# Altium project PC4-SODIMM_V200_RC_A1_20141015.PrjPcb (part 1 of 2)
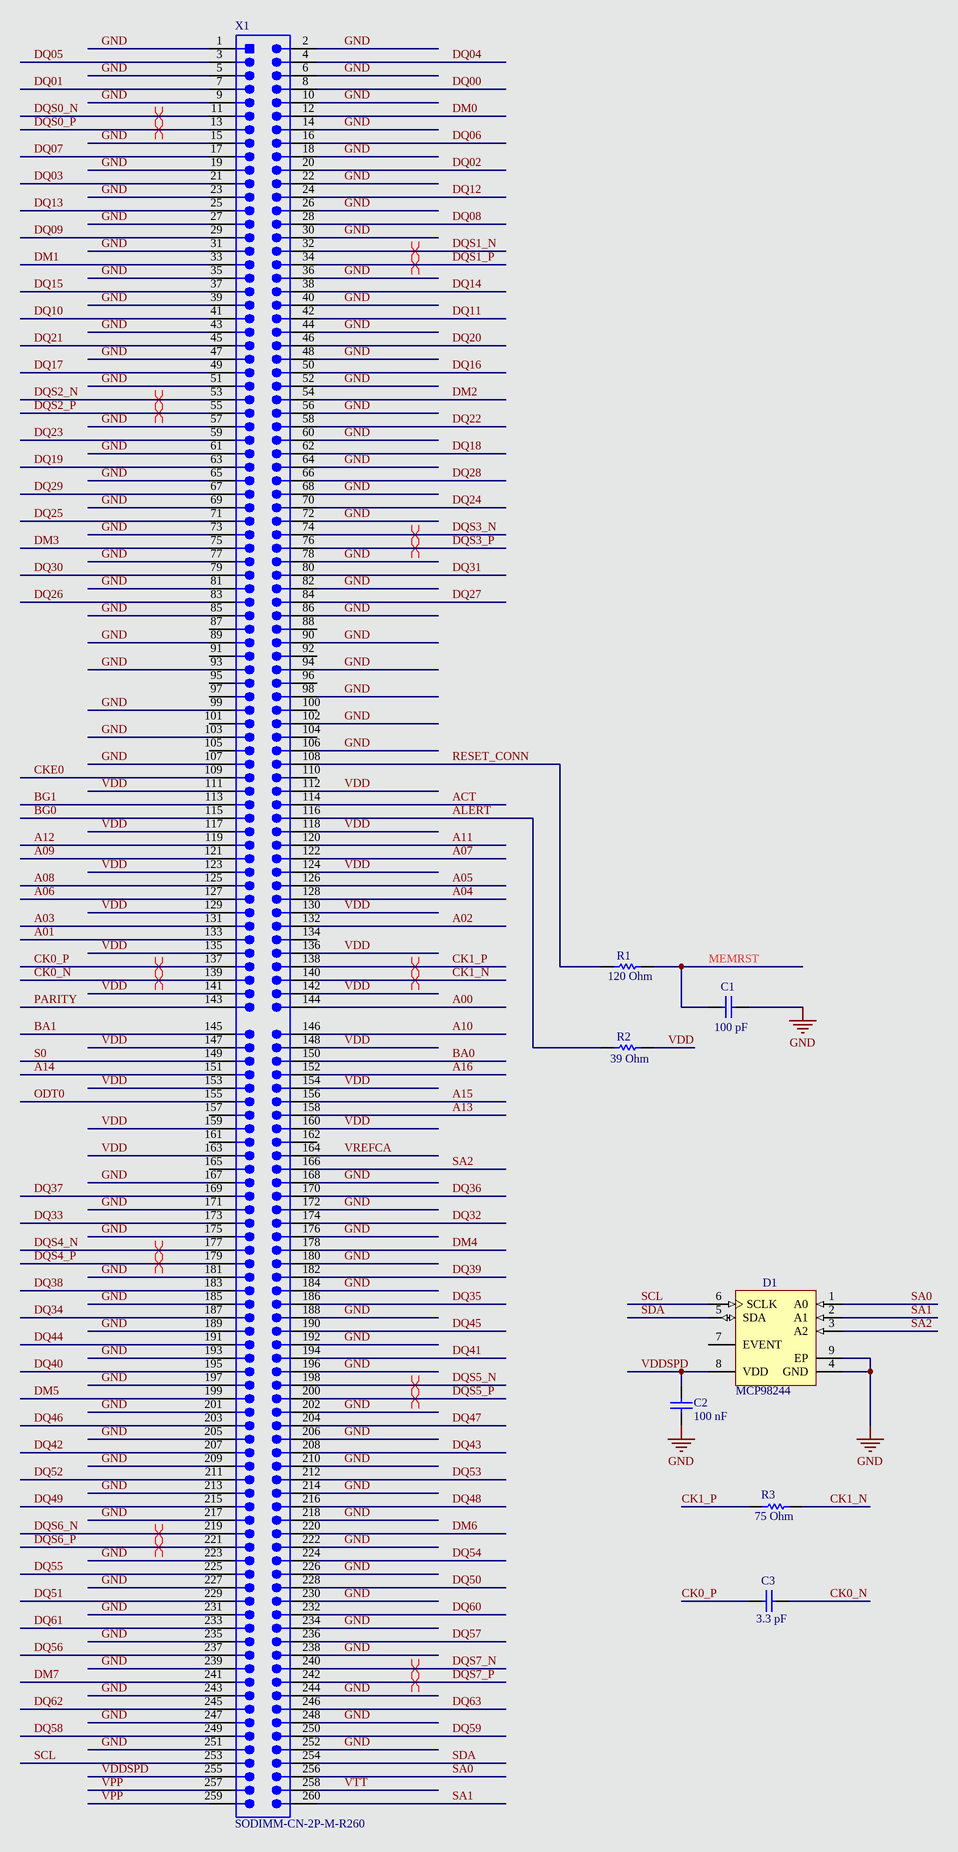
[diagram p0: Sheet1.SchDoc]
Project: Mini PC SODIMM; PrjCompanyName: Altium; PrjAddress4: 92037; PrjAddress3: La Jolla, CA, USA; PrjAddress2: Suite 700; PrjAddress1: 4225 Executive Sqr; CompanyWebsite: www.altium.com
5 sheets, 199 parts. Net scope: global (net labels, ports and power ports of the same name join across sheets).
Board file: PC4-SODIMM_V200_RC_A1_20141015.PcbDoc
Sheets:
  Sheet1.SchDoc
  Sheet2.SchDoc
  Sheet3.SchDoc
  Sheet4.SchDoc
  Sheet5.SchDoc

## Sheet Sheet1.SchDoc: Connector
size C; DocumentNumber: 1; SheetNumber: 1; SheetTotal: 5

### Parts
C1  Capacitance: 100 pF  [CAPC1005X55X10LL05]  (hidden comment: C1005C0G1H101K050BA)
C2  Capacitance: 100 nF  [CAPC1005X55X10LL05]  (hidden comment: C1005X7R1E104M)
C3  Capacitance: 3.3 pF  [CAPC1005X55X25NL5T10]  (hidden comment: GRM1555C1H3R3CA01D)
D1  MCP98244  [MCHP-TDFN-MNY8_V]
R1  Resistance: 120 Ohm  [RESC1005X40X25ML5T10]  (hidden comment: RC0402JR-07120RL)
R2  Resistance: 39 Ohm  [RESC1005X40X25NL5T10]  (hidden comment: RC0402JR-0739RL)
R3  Resistance: 75 Ohm  [RESC1005X40X25ML05T05]  (hidden comment: ERJ-2GEJ750X)
X1  SODIMM-CN-2P-M-R260  [SODIMM-GF-2D-500-1K-S260]  (no BOM)

### Nets
GND: C1.2 C2.1 D1.4(GND) D1.9(EP) X1.1 X1.2 X1.5 X1.6 X1.9 X1.10 X1.14 X1.15 X1.18 X1.19 X1.22 X1.23 X1.26 X1.27 X1.30 X1.31 X1.35 X1.36 X1.39 X1.40 X1.43 X1.44 X1.47 X1.48 X1.51 X1.52 X1.56 X1.57 X1.60 X1.61 X1.64 X1.65 X1.68 X1.69 X1.72 X1.73 X1.77 X1.78 X1.81 X1.82 X1.85 X1.86 X1.89 X1.90 X1.93 X1.94 X1.98 X1.99 X1.102 X1.103 X1.106 X1.107 X1.167 X1.168 X1.171 X1.172 X1.175 X1.176 X1.180 X1.181 X1.184 X1.185 X1.188 X1.189 X1.192 X1.193 X1.196 X1.197 X1.201 X1.202 X1.205 X1.206 X1.209 X1.210 X1.213 X1.214 X1.217 X1.218 X1.222 X1.223 X1.226 X1.227 X1.230 X1.231 X1.234 X1.235 X1.238 X1.239 X1.243 X1.244 X1.247 X1.248 X1.251 X1.252
A00: X1.144
A01: X1.133
A02: X1.132
A03: X1.131
A04: X1.128
A05: X1.126
A06: X1.127
A07: X1.122
A08: X1.125
A09: X1.121
A10: X1.146
A11: X1.120
A12: X1.119
A13: X1.158
A14: X1.151
A15: X1.156
A16: X1.152
ACT: X1.114
ALERT: R2.1 X1.116
BA0: X1.150
BA1: X1.145
BG0: X1.115
BG1: X1.113
CK0_N: C3.2 X1.139
CK0_P: C3.1 X1.137
CK1_N: R3.2 X1.140
CK1_P: R3.1 X1.138
CKE0: X1.109
DM0: X1.12
DM1: X1.33
DM2: X1.54
DM3: X1.75
DM4: X1.178
DM5: X1.199
DM6: X1.220
DM7: X1.241
DQ00: X1.8
DQ01: X1.7
DQ02: X1.20
DQ03: X1.21
DQ04: X1.4
DQ05: X1.3
DQ06: X1.16
DQ07: X1.17
DQ08: X1.28
DQ09: X1.29
DQ10: X1.41
DQ11: X1.42
DQ12: X1.24
DQ13: X1.25
DQ14: X1.38
DQ15: X1.37
DQ16: X1.50
DQ17: X1.49
DQ18: X1.62
DQ19: X1.63
DQ20: X1.46
DQ21: X1.45
DQ22: X1.58
DQ23: X1.59
DQ24: X1.70
DQ25: X1.71
DQ26: X1.83
DQ27: X1.84
DQ28: X1.66
DQ29: X1.67
DQ30: X1.79
DQ31: X1.80
DQ32: X1.174
DQ33: X1.173
DQ34: X1.187
DQ35: X1.186
DQ36: X1.170
DQ37: X1.169
DQ38: X1.183
DQ39: X1.182
DQ40: X1.195
DQ41: X1.194
DQ42: X1.207
DQ43: X1.208
DQ44: X1.191
DQ45: X1.190
DQ46: X1.203
DQ47: X1.204
DQ48: X1.216
DQ49: X1.215
DQ50: X1.228
DQ51: X1.229
DQ52: X1.211
DQ53: X1.212
DQ54: X1.224
DQ55: X1.225
DQ56: X1.237
DQ57: X1.236
DQ58: X1.249
DQ59: X1.250
DQ60: X1.232
DQ61: X1.233
DQ62: X1.245
DQ63: X1.246
DQS0_N: X1.11
DQS0_P: X1.13
DQS1_N: X1.32
DQS1_P: X1.34
DQS2_N: X1.53
DQS2_P: X1.55
DQS3_N: X1.74
DQS3_P: X1.76
DQS4_N: X1.177
DQS4_P: X1.179
DQS5_N: X1.198
DQS5_P: X1.200
DQS6_N: X1.219
DQS6_P: X1.221
DQS7_N: X1.240
DQS7_P: X1.242
MEMRST: C1.1 R1.2
ODT0: X1.155
PARITY: X1.143
RESET_CONN: R1.1 X1.108
S0: X1.149
SA0: D1.1(A0) X1.256
SA1: D1.2(A1) X1.260
SA2: D1.3(A2) X1.166
SCL: D1.6(SCLK) X1.253
SDA: D1.5(SDA) X1.254
VDD: R2.2 X1.111 X1.112 X1.117 X1.118 X1.123 X1.124 X1.129 X1.130 X1.135 X1.136 X1.141 X1.142 X1.147 X1.148 X1.153 X1.154 X1.159 X1.160 X1.163
VDDSPD: C2.2 D1.8(VDD) X1.255
VPP: X1.257 X1.259
VREFCA: X1.164
VTT: X1.258

Not connected (* = marked no-connect by the designer): D1 7(EVENT); X1 87 88 91 92 95 96 97 100 101 104 105 110 134 157 161 162 165

### Layout directives
differential pair: CK0_N, CK0_P, CK1_N, CK1_P, DQS0_N, DQS0_P, DQS1_N, DQS1_P, DQS2_N, DQS2_P, DQS3_N, DQS3_P, DQS4_N, DQS4_P, DQS5_N, DQS5_P, DQS6_N, DQS6_P, DQS7_N, DQS7_P

### Notes on the sheet
- Title
- Size:
- Date:
- File:
- C
- Number:
- Time:
- Revision:
- Sheet
- of

### Library data of the parts
C1 = CMP-1663-00011-2: Chip Capacitor, 100 pF, +/- 10%, 50 V, -55 to 125 degC, 0402 (1005 Metric), RoHS, Tape and Reel; Voltage Rating: 50 V; ComponentLink2URL: http://datasheet.octopart.com/C-Series-Ceramic-Chip-Capacitors-TDK-datasheet-family-84.pdf; Package Quantity: 10000; DatasheetVersion: 04/2012; Mounting Technology: Surface Mount; ComponentLink1Description: Manufacturer URL; Packaging: Tape and Reel; Tolerance: 10%; Max Operating Temperature: 125 degC; RoHSCompliant: true; ComponentLink1URL: http://www.tdk.com/; Min Operating Temperature: -55 degC; PackageDescription: 2-Pin Surface Mount Device, Body 1 x 0.5 mm; Case/Package: 0402; Mount: Surface Mount; PartNumber: C1005C0G1H101K050BA; ComponentLink2Description: Datasheet
C2 = CMP-1663-00009-2: Chip Capacitor, 0.1 uF, +/- 20%, 25 V, -55 to 125 degC, 0402 (1005 Metric), RoHS, Tape and Reel; Voltage Rating: 25 V; Type (Capacitors): X7R; Case\/Package: 0402; PackageReference: 0402; Tolerance: 20%; Height: 0.5 mm; Package Quantity: 10000; Mounting Technology: Surface Mount; Width: 0.5 mm; Packaging: Tape and Reel; Case Code (Metric): 1005; Pins: 2; Voltage Rating (DC): 25 V; ComponentLink2URL: http://www.farnell.com/datasheets/1571323.pdf; ComponentLink1URL: http://www.tdk.com/; PackageDescription: 2-Pin Surface Mount Device, Body 1 x 0.5 mm; Max Operating Temperature: 125 degC; ComponentLink2Description: Datasheet; PartNumber: C1005X7R1E104M; Mount: Surface Mount; RoHSCompliant: true; ComponentLink1Description: Manufacturer URL; Min Operating Temperature: -55 degC; Length: 1 mm; Case Code (Imperial): 0402; DatasheetVersion: 09/2011
C3 = CMP-2008-04352-2: Chip Capacitor, 3.3 pF, +/- 0.25 pF, 50 V, -55 to 125 degC, 0402 (1005 Metric), RoHS, Tape and Reel; Type (Capacitors): C0G; Voltage Rating: 50 V; PartNumber: GRM1555C1H3R3CA01D; Package Quantity: 10000; Mounting Technology: Surface Mount; Case Code (Metric): 1005; ComponentLink1Description: Manufacturer URL; PackageDescription: 2-Pin Surface Mount Device, Body 1 x 0.5 mm; Length: 0.039 inch; RoHSCompliant: true; ComponentLink1URL: http://www.murata.com/; Height: 0.5 mm; Max Operating Temperature: 125 degC; REACH SVHC: No SVHC; ComponentLink2URL: http://search.murata.co.jp/Ceramy/image/img/A01X/G101/ENG/GRM1555C1H3R3CA01-01.pdf; Width: 0.02 inch; Mount: Surface Mount; Min Operating Temperature: -55 degC; Case Code (Imperial): 0402; Case/Package: 0402; Radiation Hardening: No; Voltage Rating (DC): 50 V; ComponentLink2Description: Datasheet; Packaging: Tape and Reel; DatasheetVersion: 03/2016
D1 = CMP-1721-00006-1: DDR4 DIMM Temperature Sensor with EEPROM for SPD, 1.7 to 3.6 V, -65 to 150 degC, 8-PinTDFN, Pb-free, Tape and Reel; PackageDescription: 8-Pin Thin Dual Flat No-lead Package, Body 2 x 3 mm, Pitch 0.5 mm; Mounting Technology: Surface Mount; ComponentLink1Description: Manufacturer URL; ComponentLink2Description: Datasheet; ComponentLink2URL: http://ww1.microchip.com/downloads/en/DeviceDoc/22327C.pdf; PartNumber: MCP98244; DatasheetVersion: Rev. C, 05/2013; ComponentLink1URL: http://www.microchip.com/
R1 = CMP-2002-07920-2: Chip Resistor, 120 Ohm, +/- 5%, 0.063 W, -55 to 155 degC, 0402 (1005 Metric), RoHS, Tape and Reel; Voltage Rating: 50 V; Type (Resistor): Thick Film; Power Rating: 63 mW; Packaging: Tape and Reel; Tolerance: 5%; Case/Package: 0402; Min Operating Temperature: -55 degC; DatasheetVersion: Rev. 4, 02/2016; Pins: 2; Width: 0.5 mm; Mount: Surface Mount; ComponentLink1Description: Manufacturer URL; Package Quantity: 10000; Max Operating Temperature: 155 degC; Case Code (Metric): 1005; PackageDescription: 2-Pin Surface Mount Device, Body 1 x 0.5 mm; Height: 0.35 mm; Mounting Technology: Surface Mount; ComponentLink1URL: http://www.yageo.com/; ComponentLink2URL: http://www.yageo.com/documents/recent/PYu-RC_Group_51_RoHS_L_04.pdf; RoHSCompliant: true; Case Code (Imperial): 0402; Voltage Rating (DC): 50 V; REACH SVHC: No SVHC; ComponentLink2Description: Datasheet; Length: 1 mm; PartNumber: RC0402JR-07120RL
R2 = CMP-2002-07994-2: Chip Resistor, 39 Ohm, +/- 5%, 0.063 W, -55 to 155 degC, 0402 (1005 Metric), RoHS, Tape and Reel; Power Rating: 63 mW; Voltage Rating (DC): 50 V; Case Code (Imperial): 0402; Mount: Surface Mount; Max Operating Temperature: 155 degC; Case Code (Metric): 1005; ComponentLink1Description: Manufacturer URL; PackageDescription: 2-Pin Surface Mount Device, Body 1 x 0.5 mm; PartNumber: RC0402JR-0739RL; ComponentLink2Description: Datasheet; Tolerance: 5%; Height: 0.35 mm; Pins: 2; Min Operating Temperature: -55 degC; Length: 1 mm; DatasheetVersion: Rev. 4, 02/2016; ComponentLink2URL: http://www.yageo.com/documents/recent/PYu-RC_Group_51_RoHS_L_04.pdf; Mounting Technology: Surface Mount; Packaging: Cut Tape; Case/Package: 0402; Package Quantity: 1; RoHSCompliant: true; REACH SVHC: No SVHC; Width: 0.5 mm; Voltage Rating: 50 V; ComponentLink1URL: http://www.yageo.com/
R3 = CMP-2002-00578-3: Chip Resistor, 75 Ohm, +/- 5%, 100 mW, -55 to 155 degC, 0402 (1005 Metric), RoHS, Tape and Reel; Manufacturer: Basic Passives; Power Rating: 100 mW; Voltage Rating: 50 V; Case\/Package: 0402; Height: 0.35 mm; PackageReference: 0402; Package Quantity: 10000; Mounting Technology: Surface Mount; Tolerance: 5%; Length: 1 mm; ComponentLink2URL: http://industrial.panasonic.com/cdbs/www-data/pdf/RDA0000/AOA0000C84.pdf; Mount: Surface Mount; DatasheetVersion: 03/2015; RoHSCompliant: true; PartNumber: ERJ-2GEJ750X; Max Operating Temperature: 155 degC; REACH SVHC: Unknown; ComponentLink2Description: Datasheet; Case Code (Imperial): 0402; ComponentLink1URL: http://www.panasonic.com/; PackageDescription: 2-Pin Surface Mount Device, Body 1 x 0.5 mm; Radiation Hardening: No; Width: 0.5 mm; Pins: 2; ComponentLink1Description: Manufacturer URL; Packaging: Tape and Reel; Min Operating Temperature: -55 degC; Case Code (Metric): 1005
X1 = CMP-0001-00005-1: Golden finger, SODIMM, Dual, Staggered, Pitch 0.5mm, 260-Position; Class Name: Edge Connector; Mating Connector: AS0A823-H4SB-7H; System: Connector; Package Reference: SODIMM-GF-2D-500-1K-S260; Publisher: Altium

## Sheet Sheet2.SchDoc: TERMINATION RESISTORS
size B; DocumentNumber: 2; SheetNumber: 2; SheetTotal: 5
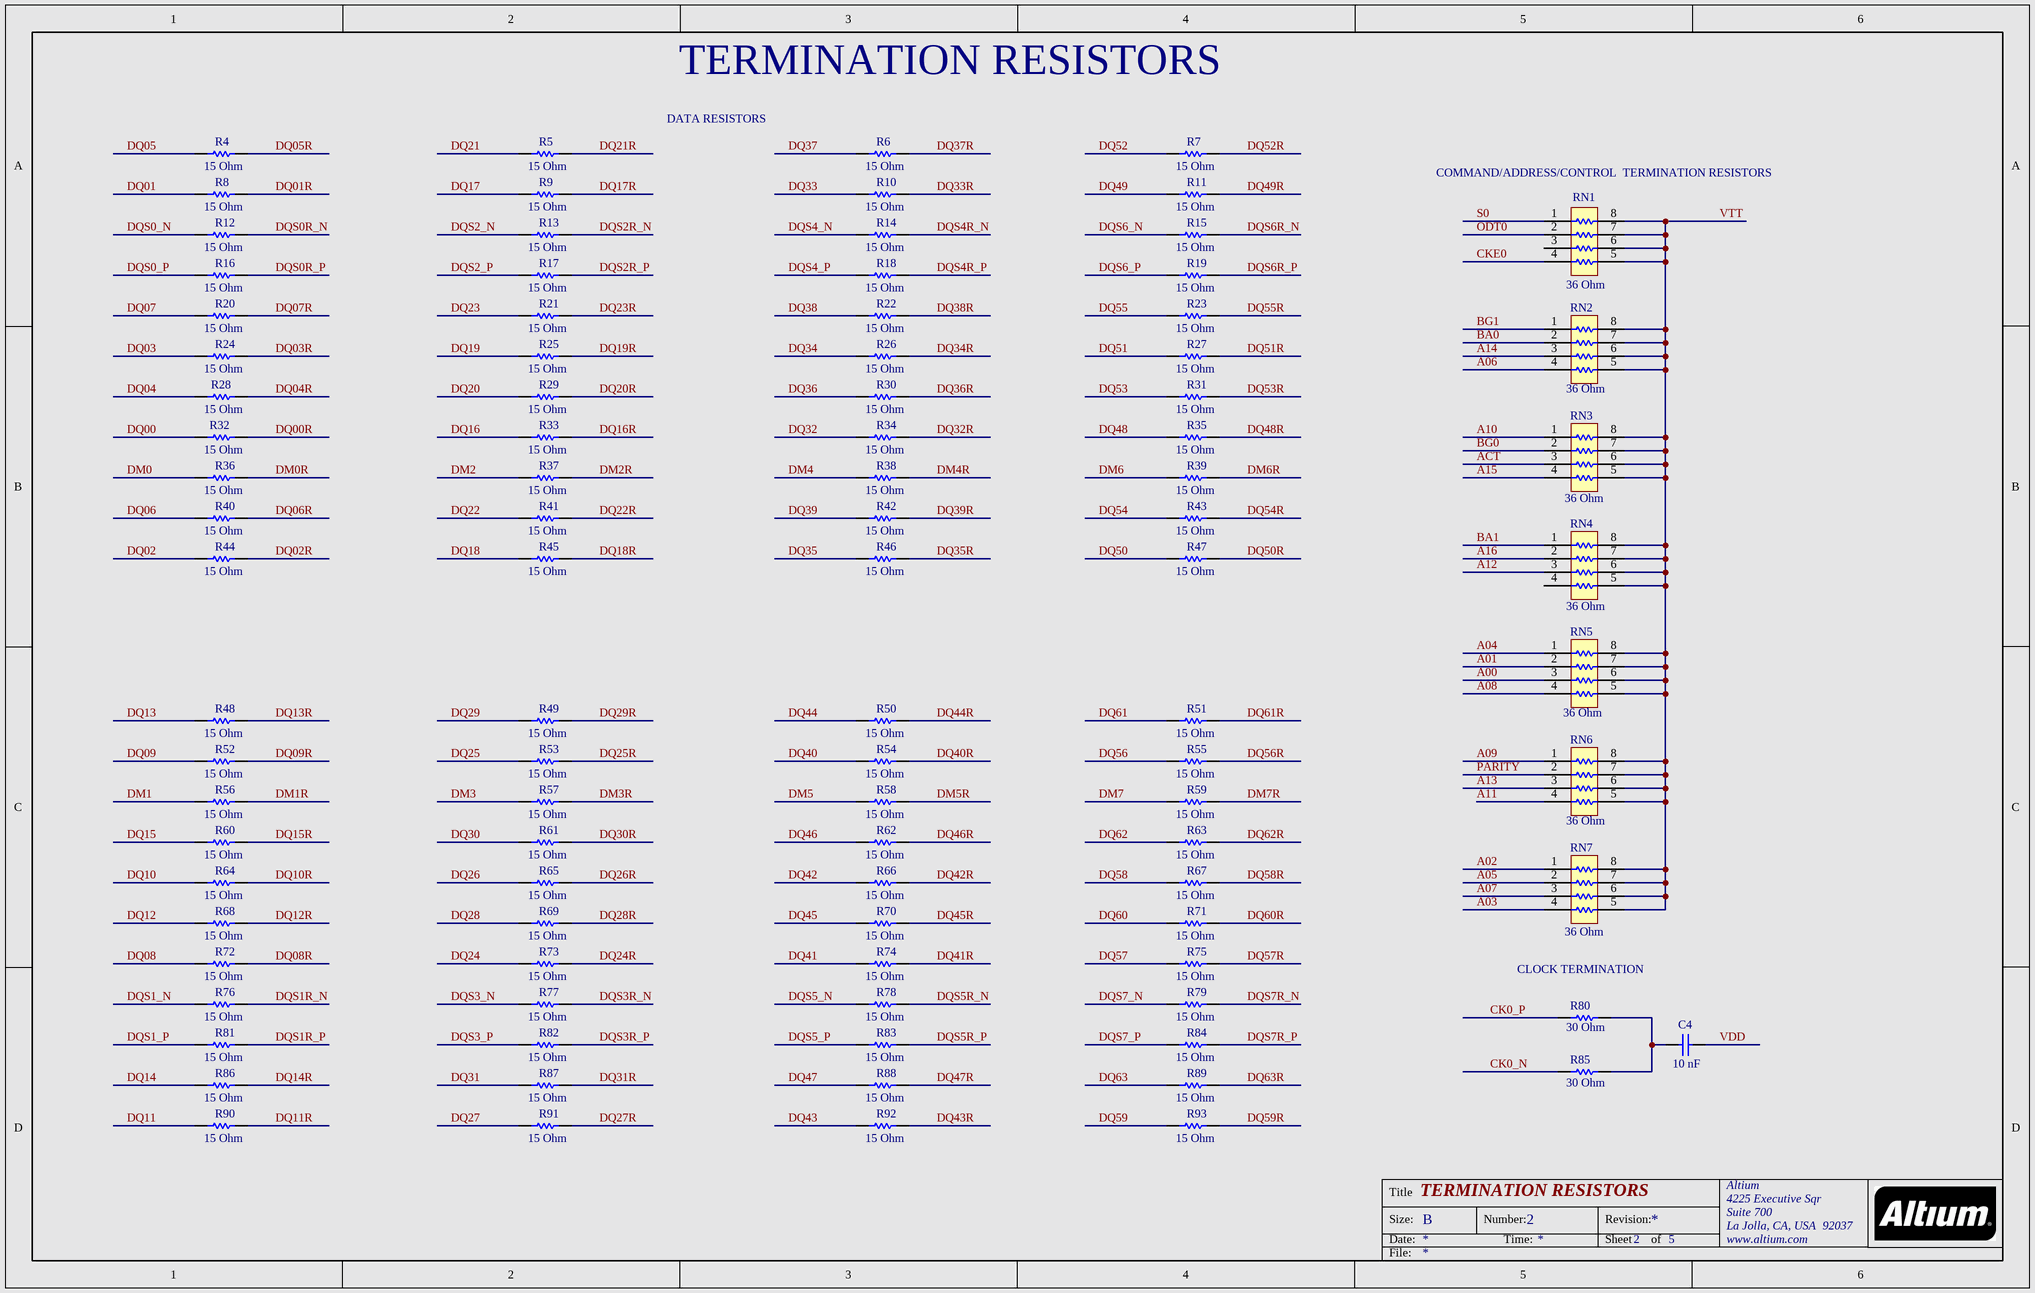
[diagram p1: Sheet2.SchDoc]

### Parts
C4  Capacitance: 10 nF  [CAPC1005X55X10NL05]  (hidden comment: C1005X7R1E103M050BB)
R4  Resistance: 15 Ohm  [RESC0603X26X15ML03T05]  (hidden comment: ERJ-1GEJ150C)
R5  Resistance: 15 Ohm  [RESC0603X26X15ML03T05]  (hidden comment: ERJ-1GEJ150C)
R6  Resistance: 15 Ohm  [RESC0603X26X15ML03T05]  (hidden comment: ERJ-1GEJ150C)
R7  Resistance: 15 Ohm  [RESC0603X26X15ML03T05]  (hidden comment: ERJ-1GEJ150C)
R8  Resistance: 15 Ohm  [RESC0603X26X15ML03T05]  (hidden comment: ERJ-1GEJ150C)
R9  Resistance: 15 Ohm  [RESC0603X26X15ML03T05]  (hidden comment: ERJ-1GEJ150C)
R10  Resistance: 15 Ohm  [RESC0603X26X15ML03T05]  (hidden comment: ERJ-1GEJ150C)
R11  Resistance: 15 Ohm  [RESC0603X26X15ML03T05]  (hidden comment: ERJ-1GEJ150C)
R12  Resistance: 15 Ohm  [RESC0603X26X15ML03T05]  (hidden comment: ERJ-1GEJ150C)
R13  Resistance: 15 Ohm  [RESC0603X26X15ML03T05]  (hidden comment: ERJ-1GEJ150C)
R14  Resistance: 15 Ohm  [RESC0603X26X15ML03T05]  (hidden comment: ERJ-1GEJ150C)
R15  Resistance: 15 Ohm  [RESC0603X26X15ML03T05]  (hidden comment: ERJ-1GEJ150C)
R16  Resistance: 15 Ohm  [RESC0603X26X15ML03T05]  (hidden comment: ERJ-1GEJ150C)
R17  Resistance: 15 Ohm  [RESC0603X26X15ML03T05]  (hidden comment: ERJ-1GEJ150C)
R18  Resistance: 15 Ohm  [RESC0603X26X15ML03T05]  (hidden comment: ERJ-1GEJ150C)
R19  Resistance: 15 Ohm  [RESC0603X26X15ML03T05]  (hidden comment: ERJ-1GEJ150C)
R20  Resistance: 15 Ohm  [RESC0603X26X15ML03T05]  (hidden comment: ERJ-1GEJ150C)
R21  Resistance: 15 Ohm  [RESC0603X26X15ML03T05]  (hidden comment: ERJ-1GEJ150C)
R22  Resistance: 15 Ohm  [RESC0603X26X15ML03T05]  (hidden comment: ERJ-1GEJ150C)
R23  Resistance: 15 Ohm  [RESC0603X26X15ML03T05]  (hidden comment: ERJ-1GEJ150C)
R24  Resistance: 15 Ohm  [RESC0603X26X15ML03T05]  (hidden comment: ERJ-1GEJ150C)
R25  Resistance: 15 Ohm  [RESC0603X26X15ML03T05]  (hidden comment: ERJ-1GEJ150C)
R26  Resistance: 15 Ohm  [RESC0603X26X15ML03T05]  (hidden comment: ERJ-1GEJ150C)
R27  Resistance: 15 Ohm  [RESC0603X26X15ML03T05]  (hidden comment: ERJ-1GEJ150C)
R28  Resistance: 15 Ohm  [RESC0603X26X15ML03T05]  (hidden comment: ERJ-1GEJ150C)
R29  Resistance: 15 Ohm  [RESC0603X26X15ML03T05]  (hidden comment: ERJ-1GEJ150C)
R30  Resistance: 15 Ohm  [RESC0603X26X15ML03T05]  (hidden comment: ERJ-1GEJ150C)
R31  Resistance: 15 Ohm  [RESC0603X26X15ML03T05]  (hidden comment: ERJ-1GEJ150C)
R32  Resistance: 15 Ohm  [RESC0603X26X15ML03T05]  (hidden comment: ERJ-1GEJ150C)
R33  Resistance: 15 Ohm  [RESC0603X26X15ML03T05]  (hidden comment: ERJ-1GEJ150C)
R34  Resistance: 15 Ohm  [RESC0603X26X15ML03T05]  (hidden comment: ERJ-1GEJ150C)
R35  Resistance: 15 Ohm  [RESC0603X26X15ML03T05]  (hidden comment: ERJ-1GEJ150C)
R36  Resistance: 15 Ohm  [RESC0603X26X15ML03T05]  (hidden comment: ERJ-1GEJ150C)
R37  Resistance: 15 Ohm  [RESC0603X26X15ML03T05]  (hidden comment: ERJ-1GEJ150C)
R38  Resistance: 15 Ohm  [RESC0603X26X15ML03T05]  (hidden comment: ERJ-1GEJ150C)
R39  Resistance: 15 Ohm  [RESC0603X26X15ML03T05]  (hidden comment: ERJ-1GEJ150C)
R40  Resistance: 15 Ohm  [RESC0603X26X15ML03T05]  (hidden comment: ERJ-1GEJ150C)
R41  Resistance: 15 Ohm  [RESC0603X26X15ML03T05]  (hidden comment: ERJ-1GEJ150C)
R42  Resistance: 15 Ohm  [RESC0603X26X15ML03T05]  (hidden comment: ERJ-1GEJ150C)
R43  Resistance: 15 Ohm  [RESC0603X26X15ML03T05]  (hidden comment: ERJ-1GEJ150C)
R44  Resistance: 15 Ohm  [RESC0603X26X15ML03T05]  (hidden comment: ERJ-1GEJ150C)
R45  Resistance: 15 Ohm  [RESC0603X26X15ML03T05]  (hidden comment: ERJ-1GEJ150C)
R46  Resistance: 15 Ohm  [RESC0603X26X15ML03T05]  (hidden comment: ERJ-1GEJ150C)
R47  Resistance: 15 Ohm  [RESC0603X26X15ML03T05]  (hidden comment: ERJ-1GEJ150C)
R48  Resistance: 15 Ohm  [RESC0603X26X15ML03T05]  (hidden comment: ERJ-1GEJ150C)
R49  Resistance: 15 Ohm  [RESC0603X26X15ML03T05]  (hidden comment: ERJ-1GEJ150C)
R50  Resistance: 15 Ohm  [RESC0603X26X15ML03T05]  (hidden comment: ERJ-1GEJ150C)
R51  Resistance: 15 Ohm  [RESC0603X26X15ML03T05]  (hidden comment: ERJ-1GEJ150C)
R52  Resistance: 15 Ohm  [RESC0603X26X15ML03T05]  (hidden comment: ERJ-1GEJ150C)
R53  Resistance: 15 Ohm  [RESC0603X26X15ML03T05]  (hidden comment: ERJ-1GEJ150C)
R54  Resistance: 15 Ohm  [RESC0603X26X15ML03T05]  (hidden comment: ERJ-1GEJ150C)
R55  Resistance: 15 Ohm  [RESC0603X26X15ML03T05]  (hidden comment: ERJ-1GEJ150C)
R56  Resistance: 15 Ohm  [RESC0603X26X15ML03T05]  (hidden comment: ERJ-1GEJ150C)
R57  Resistance: 15 Ohm  [RESC0603X26X15ML03T05]  (hidden comment: ERJ-1GEJ150C)
R58  Resistance: 15 Ohm  [RESC0603X26X15ML03T05]  (hidden comment: ERJ-1GEJ150C)
R59  Resistance: 15 Ohm  [RESC0603X26X15ML03T05]  (hidden comment: ERJ-1GEJ150C)
R60  Resistance: 15 Ohm  [RESC0603X26X15ML03T05]  (hidden comment: ERJ-1GEJ150C)
R61  Resistance: 15 Ohm  [RESC0603X26X15ML03T05]  (hidden comment: ERJ-1GEJ150C)
R62  Resistance: 15 Ohm  [RESC0603X26X15ML03T05]  (hidden comment: ERJ-1GEJ150C)
R63  Resistance: 15 Ohm  [RESC0603X26X15ML03T05]  (hidden comment: ERJ-1GEJ150C)
R64  Resistance: 15 Ohm  [RESC0603X26X15ML03T05]  (hidden comment: ERJ-1GEJ150C)
R65  Resistance: 15 Ohm  [RESC0603X26X15ML03T05]  (hidden comment: ERJ-1GEJ150C)
R66  Resistance: 15 Ohm  [RESC0603X26X15ML03T05]  (hidden comment: ERJ-1GEJ150C)
R67  Resistance: 15 Ohm  [RESC0603X26X15ML03T05]  (hidden comment: ERJ-1GEJ150C)
R68  Resistance: 15 Ohm  [RESC0603X26X15ML03T05]  (hidden comment: ERJ-1GEJ150C)
R69  Resistance: 15 Ohm  [RESC0603X26X15ML03T05]  (hidden comment: ERJ-1GEJ150C)
R70  Resistance: 15 Ohm  [RESC0603X26X15ML03T05]  (hidden comment: ERJ-1GEJ150C)
R71  Resistance: 15 Ohm  [RESC0603X26X15ML03T05]  (hidden comment: ERJ-1GEJ150C)
R72  Resistance: 15 Ohm  [RESC0603X26X15ML03T05]  (hidden comment: ERJ-1GEJ150C)
R73  Resistance: 15 Ohm  [RESC0603X26X15ML03T05]  (hidden comment: ERJ-1GEJ150C)
R74  Resistance: 15 Ohm  [RESC0603X26X15ML03T05]  (hidden comment: ERJ-1GEJ150C)
R75  Resistance: 15 Ohm  [RESC0603X26X15ML03T05]  (hidden comment: ERJ-1GEJ150C)
R76  Resistance: 15 Ohm  [RESC0603X26X15ML03T05]  (hidden comment: ERJ-1GEJ150C)
R77  Resistance: 15 Ohm  [RESC0603X26X15ML03T05]  (hidden comment: ERJ-1GEJ150C)
R78  Resistance: 15 Ohm  [RESC0603X26X15ML03T05]  (hidden comment: ERJ-1GEJ150C)
R79  Resistance: 15 Ohm  [RESC0603X26X15ML03T05]  (hidden comment: ERJ-1GEJ150C)
R80  Resistance: 30 Ohm  [RESC1005X40X25NL5T10]  (hidden comment: RC0402JR-0730RL)
R81  Resistance: 15 Ohm  [RESC0603X26X15ML03T05]  (hidden comment: ERJ-1GEJ150C)
R82  Resistance: 15 Ohm  [RESC0603X26X15ML03T05]  (hidden comment: ERJ-1GEJ150C)
R83  Resistance: 15 Ohm  [RESC0603X26X15ML03T05]  (hidden comment: ERJ-1GEJ150C)
R84  Resistance: 15 Ohm  [RESC0603X26X15ML03T05]  (hidden comment: ERJ-1GEJ150C)
R85  Resistance: 30 Ohm  [RESC1005X40X25NL5T10]  (hidden comment: RC0402JR-0730RL)
R86  Resistance: 15 Ohm  [RESC0603X26X15ML03T05]  (hidden comment: ERJ-1GEJ150C)
R87  Resistance: 15 Ohm  [RESC0603X26X15ML03T05]  (hidden comment: ERJ-1GEJ150C)
R88  Resistance: 15 Ohm  [RESC0603X26X15ML03T05]  (hidden comment: ERJ-1GEJ150C)
R89  Resistance: 15 Ohm  [RESC0603X26X15ML03T05]  (hidden comment: ERJ-1GEJ150C)
R90  Resistance: 15 Ohm  [RESC0603X26X15ML03T05]  (hidden comment: ERJ-1GEJ150C)
R91  Resistance: 15 Ohm  [RESC0603X26X15ML03T05]  (hidden comment: ERJ-1GEJ150C)
R92  Resistance: 15 Ohm  [RESC0603X26X15ML03T05]  (hidden comment: ERJ-1GEJ150C)
R93  Resistance: 15 Ohm  [RESC0603X26X15ML03T05]  (hidden comment: ERJ-1GEJ150C)
RN1  Resistance: 36 Ohm  [BOUR-CAY10-J4_V]  (hidden comment: CAY10-360J4LF)
RN2  Resistance: 36 Ohm  [BOUR-CAY10-J4_V]  (hidden comment: CAY10-360J4LF)
RN3  Resistance: 36 Ohm  [BOUR-CAY10-J4_V]  (hidden comment: CAY10-360J4LF)
RN4  Resistance: 36 Ohm  [BOUR-CAY10-J4_V]  (hidden comment: CAY10-360J4LF)
RN5  Resistance: 36 Ohm  [BOUR-CAY10-J4_V]  (hidden comment: CAY10-360J4LF)
RN6  Resistance: 36 Ohm  [BOUR-CAY10-J4_V]  (hidden comment: CAY10-360J4LF)
RN7  Resistance: 36 Ohm  [BOUR-CAY10-J4_V]  (hidden comment: CAY10-360J4LF)

### Nets
A00: RN5.3
A01: RN5.2
A02: RN7.1
A03: RN7.4
A04: RN5.1
A05: RN7.2
A06: RN2.4
A07: RN7.3
A08: RN5.4
A09: RN6.1
A10: RN3.1
A11: RN6.4
A12: RN4.3
A13: RN6.3
A14: RN2.3
A15: RN3.4
A16: RN4.2
ACT: RN3.3
BA0: RN2.2
BA1: RN4.1
BG0: RN3.2
BG1: RN2.1
CK0_N: R85.1
CK0_P: R80.1
CKE0: RN1.4
DM0: R36.1
DM0R: R36.2
DM1: R56.1
DM1R: R56.2
DM2: R37.1
DM2R: R37.2
DM3: R57.1
DM3R: R57.2
DM4: R38.1
DM4R: R38.2
DM5: R58.1
DM5R: R58.2
DM6: R39.1
DM6R: R39.2
DM7: R59.1
DM7R: R59.2
DQ00: R32.1
DQ00R: R32.2
DQ01: R8.1
DQ01R: R8.2
DQ02: R44.1
DQ02R: R44.2
DQ03: R24.1
DQ03R: R24.2
DQ04: R28.1
DQ04R: R28.2
DQ05: R4.1
DQ05R: R4.2
DQ06: R40.1
DQ06R: R40.2
DQ07: R20.1
DQ07R: R20.2
DQ08: R72.1
DQ08R: R72.2
DQ09: R52.1
DQ09R: R52.2
DQ10: R64.1
DQ10R: R64.2
DQ11: R90.1
DQ11R: R90.2
DQ12: R68.1
DQ12R: R68.2
DQ13: R48.1
DQ13R: R48.2
DQ14: R86.1
DQ14R: R86.2
DQ15: R60.1
DQ15R: R60.2
DQ16: R33.1
DQ16R: R33.2
DQ17: R9.1
DQ17R: R9.2
DQ18: R45.1
DQ18R: R45.2
DQ19: R25.1
DQ19R: R25.2
DQ20: R29.1
DQ20R: R29.2
DQ21: R5.1
DQ21R: R5.2
DQ22: R41.1
DQ22R: R41.2
DQ23: R21.1
DQ23R: R21.2
DQ24: R73.1
DQ24R: R73.2
DQ25: R53.1
DQ25R: R53.2
DQ26: R65.1
DQ26R: R65.2
DQ27: R91.1
DQ27R: R91.2
DQ28: R69.1
DQ28R: R69.2
DQ29: R49.1
DQ29R: R49.2
DQ30: R61.1
DQ30R: R61.2
DQ31: R87.1
DQ31R: R87.2
DQ32: R34.1
DQ32R: R34.2
DQ33: R10.1
DQ33R: R10.2
DQ34: R26.1
DQ34R: R26.2
DQ35: R46.1
DQ35R: R46.2
DQ36: R30.1
DQ36R: R30.2
DQ37: R6.1
DQ37R: R6.2
DQ38: R22.1
DQ38R: R22.2
DQ39: R42.1
DQ39R: R42.2
DQ40: R54.1
DQ40R: R54.2
DQ41: R74.1
DQ41R: R74.2
DQ42: R66.1
DQ42R: R66.2
DQ43: R92.1
DQ43R: R92.2
DQ44: R50.1
DQ44R: R50.2
DQ45: R70.1
DQ45R: R70.2
DQ46: R62.1
DQ46R: R62.2
DQ47: R88.1
DQ47R: R88.2
DQ48: R35.1
DQ48R: R35.2
DQ49: R11.1
DQ49R: R11.2
DQ50: R47.1
DQ50R: R47.2
DQ51: R27.1
DQ51R: R27.2
DQ52: R7.1
DQ52R: R7.2
DQ53: R31.1
DQ53R: R31.2
DQ54: R43.1
DQ54R: R43.2
DQ55: R23.1
DQ55R: R23.2
DQ56: R55.1
DQ56R: R55.2
DQ57: R75.1
DQ57R: R75.2
DQ58: R67.1
DQ58R: R67.2
DQ59: R93.1
DQ59R: R93.2
DQ60: R71.1
DQ60R: R71.2
DQ61: R51.1
DQ61R: R51.2
DQ62: R63.1
DQ62R: R63.2
DQ63: R89.1
DQ63R: R89.2
DQS0_N: R12.1
DQS0_P: R16.1
DQS0R_N: R12.2
DQS0R_P: R16.2
DQS1_N: R76.1
DQS1_P: R81.1
DQS1R_N: R76.2
DQS1R_P: R81.2
DQS2_N: R13.1
DQS2_P: R17.1
DQS2R_N: R13.2
DQS2R_P: R17.2
DQS3_N: R77.1
DQS3_P: R82.1
DQS3R_N: R77.2
DQS3R_P: R82.2
DQS4_N: R14.1
DQS4_P: R18.1
DQS4R_N: R14.2
DQS4R_P: R18.2
DQS5_N: R78.1
DQS5_P: R83.1
DQS5R_N: R78.2
DQS5R_P: R83.2
DQS6_N: R15.1
DQS6_P: R19.1
DQS6R_N: R15.2
DQS6R_P: R19.2
DQS7_N: R79.1
DQS7_P: R84.1
DQS7R_N: R79.2
DQS7R_P: R84.2
ODT0: RN1.2
PARITY: RN6.2
S0: RN1.1
VDD: C4.2
VTT: RN1.5 RN1.6 RN1.7 RN1.8 RN2.5 RN2.6 RN2.7 RN2.8 RN3.5 RN3.6 RN3.7 RN3.8 RN4.5 RN4.6 RN4.7 RN4.8 RN5.5 RN5.6 RN5.7 RN5.8 RN6.5 RN6.6 RN6.7 RN6.8 RN7.5 RN7.6 RN7.7 RN7.8
NetC4_1: C4.1 R80.2 R85.2

Not connected (* = marked no-connect by the designer): RN1 3; RN4 4

### Notes on the sheet
- DATA RESISTORS
- (near RN1) COMMAND/ADDRESS/CONTROL  TERMINATION RESISTORS
- CLOCK TERMINATION
- Title
- Size:
- Date:
- B
- Number:
- Time:
- Revision:
- Sheet
- of
- File:

### Library data of the parts
C4 = CMP-1663-00012-1: Chip Capacitor, 10 nF, +/- 15%, 25 V, -55 to 125 degC, 0402 (1005 Metric), RoHS, Tape and Reel; Voltage Rating: 25 V; Type (Capacitors): X7R; Tolerance: 20%; Width: 0.5 mm; ComponentLink2Description: Datasheet; Max Operating Temperature: 125 degC; PartNumber: C1005X7R1E103M050BB; Mounting Technology: Surface Mount; Case Code (Metric): 1005; ComponentLink1Description: Manufacturer URL; Case Code (Imperial): 0402; PackageDescription: 2-Pin Surface Mount Device, Body 1 x 0.5 mm; ComponentLink1URL: http://www.tdk.com/; Mount: Surface Mount; Package Quantity: 10000; ComponentLink2URL: https://ciiva.com/datasheet-click-20389836?src=ciiva&sig=78734acc; Voltage Rating (DC): 25 V; Length: 1 mm; DatasheetVersion: 03/2015; Height: 0.5 mm; RoHSCompliant: true; Case/Package: 0402; Packaging: Tape and Reel; Min Operating Temperature: -55 degC
R4-R79 R81-R84 R86-R93 = CMP-2004-03155-3: Chip Resistor, 15 Ohm, +/- 5%, 0.05 W, -55 to 125 degC, 0201 (0603 Metric), RoHS, Tape and Reel; Voltage Rating: 25 V; Power Rating: 50 mW; PackageDescription: 2-Pin Surface Mount Device, Body 0.6 x 0.3 mm; Width: 0.3 mm; Length: 0.6 mm; Height: 0.23 mm; Packaging: Tape and Reel; Case Code (Metric): 0603; RoHSCompliant: true; Case/Package: 0201; ComponentLink2Description: Datasheet; Package Quantity: 15000; Max Operating Temperature: 125 degC; Tolerance: 5%; ComponentLink1URL: http://www.panasonic.com/; Min Operating Temperature: -55 degC; PartNumber: ERJ-1GEJ150C; ComponentLink1Description: Manufacturer URL; ComponentLink2URL: http://media.digikey.com/pdf/Data%20Sheets/Panasonic%20Resistors%20Thermistors%20PDFs/ERJ%205%25.pdf; DatasheetVersion: 03/2005; Case Code (Imperial): 0201; Mounting Technology: Surface Mount
R80 R85 = CMP-2002-07983-2: Chip Resistor, 30 Ohm, +/- 5%, 0.063 W, -55 to 155 degC, 0402 (1005 Metric), RoHS, Tape and Reel; Voltage Rating: 50 V; Power Rating: 63 mW; Case/Package: 0402; ComponentLink2URL: http://www.yageo.com/documents/recent/PYu-RC_Group_51_RoHS_L_04.pdf; Height: 0.35 mm; RoHSCompliant: true; Case Code (Imperial): 0402; ComponentLink1URL: http://www.yageo.com/; Width: 0.5 mm; Tolerance: 5%; Max Operating Temperature: 155 degC; PackageDescription: 2-Pin Surface Mount Device, Body 1 x 0.5 mm; Radiation Hardening: No; Min Operating Temperature: -55 degC; PartNumber: RC0402JR-0730RL; Packaging: Tape and Reel; ComponentLink2Description: Datasheet; Length: 1 mm; Package Quantity: 10000; Case Code (Metric): 1005; ComponentLink1Description: Manufacturer URL; DatasheetVersion: Rev. 4, 02/2016; Mounting Technology: Surface Mount; Mount: Surface Mount
RN1-RN7 = CMP-1734-00001-1: Chip Resistor Array, 36 Ohm, +/- 5%, 62.5 mW, -55 to 125 degC, 8-Pin SMD, RoHS, Tape and Reel; Power Rating: 120 mW; Type (Resistor): Thick Film; ComponentLink1URL: http://www.bourns.com/; ComponentLink2Description: Datasheet; Height: 0.018 inch; Mounting Technology: Surface Mount; ComponentLink2URL: http://www.bourns.com/docs/Product-Datasheets/CAY10.pdf; PartNumber: CAY10-360J4LF; Case Code (Metric): 2010; ComponentLink1Description: Manufacturer URL; DatasheetVersion: 01/2015; Width: 0.039 inch; Packaging: Tape and Reel; Pins: 8; RoHSCompliant: true; Mount: Surface Mount; Package Quantity: 10000; Length: 0.079 inch; PackageDescription: 8-Pin Surface Mount Device, Body 2 x 1 mm, Pitch 0.5 mm; Max Operating Temperature: 125 degC; Min Operating Temperature: -55 degC; Case/Package: 0804; Tolerance: 5%

## Sheet Sheet3.SchDoc: Memory ICs
size B; DocumentNumber: 3; SheetNumber: 3; SheetTotal: 5
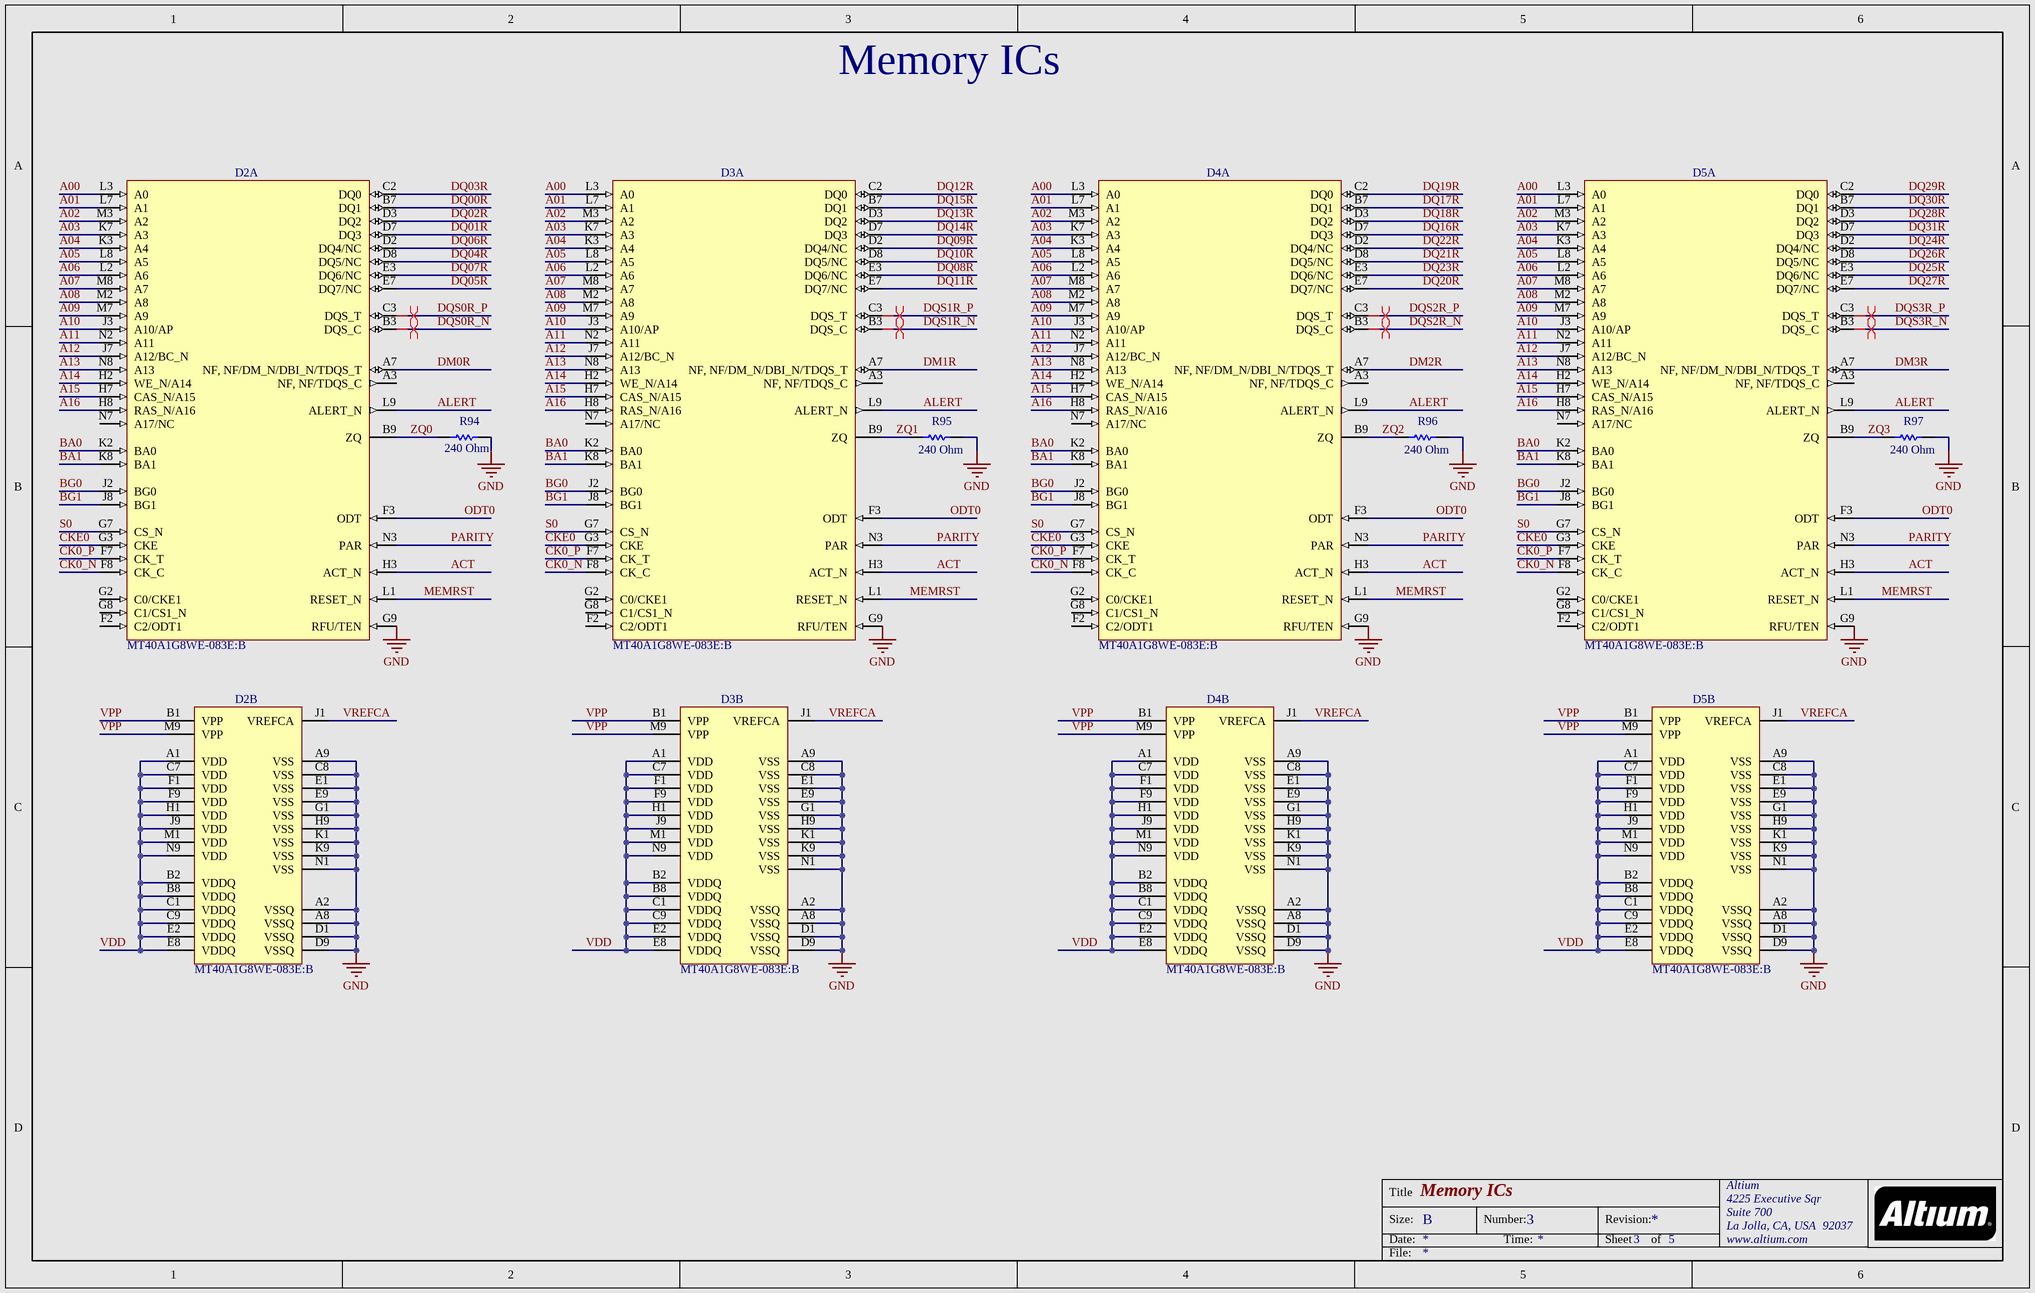
[diagram p2: Sheet3.SchDoc]

### Parts
D2  MT40A1G8WE-083E:B  [MICT-WE-78]  (parts A,B of 2)
D3  MT40A1G8WE-083E:B  [MICT-WE-78]  (parts A,B of 2)
D4  MT40A1G8WE-083E:B  [MICT-WE-78]  (parts A,B of 2)
D5  MT40A1G8WE-083E:B  [MICT-WE-78]  (parts A,B of 2)
R94  Resistance: 240 Ohm  [RESC1005X40X25ML05T05]  (hidden comment: ERJ-2GEJ241x)
R95  Resistance: 240 Ohm  [RESC1005X40X25ML05T05]  (hidden comment: ERJ-2GEJ241x)
R96  Resistance: 240 Ohm  [RESC1005X40X25ML05T05]  (hidden comment: ERJ-2GEJ241x)
R97  Resistance: 240 Ohm  [RESC1005X40X25ML05T05]  (hidden comment: ERJ-2GEJ241x)

### Nets
GND: D2.A2(VSSQ) D2.A8(VSSQ) D2.A9(VSS) D2.C8(VSS) D2.D1(VSSQ) D2.D9(VSSQ) D2.E1(VSS) D2.E9(VSS) D2.G1(VSS) D2.G9(RFU/TEN) D2.H9(VSS) D2.K1(VSS) D2.K9(VSS) D2.N1(VSS) D3.A2(VSSQ) D3.A8(VSSQ) D3.A9(VSS) D3.C8(VSS) D3.D1(VSSQ) D3.D9(VSSQ) D3.E1(VSS) D3.E9(VSS) D3.G1(VSS) D3.G9(RFU/TEN) D3.H9(VSS) D3.K1(VSS) D3.K9(VSS) D3.N1(VSS) D4.A2(VSSQ) D4.A8(VSSQ) D4.A9(VSS) D4.C8(VSS) D4.D1(VSSQ) D4.D9(VSSQ) D4.E1(VSS) D4.E9(VSS) D4.G1(VSS) D4.G9(RFU/TEN) D4.H9(VSS) D4.K1(VSS) D4.K9(VSS) D4.N1(VSS) D5.A2(VSSQ) D5.A8(VSSQ) D5.A9(VSS) D5.C8(VSS) D5.D1(VSSQ) D5.D9(VSSQ) D5.E1(VSS) D5.E9(VSS) D5.G1(VSS) D5.G9(RFU/TEN) D5.H9(VSS) D5.K1(VSS) D5.K9(VSS) D5.N1(VSS) R94.1 R95.1 R96.1 R97.1
A00: D2.L3(A0) D3.L3(A0) D4.L3(A0) D5.L3(A0)
A01: D2.L7(A1) D3.L7(A1) D4.L7(A1) D5.L7(A1)
A02: D2.M3(A2) D3.M3(A2) D4.M3(A2) D5.M3(A2)
A03: D2.K7(A3) D3.K7(A3) D4.K7(A3) D5.K7(A3)
A04: D2.K3(A4) D3.K3(A4) D4.K3(A4) D5.K3(A4)
A05: D2.L8(A5) D3.L8(A5) D4.L8(A5) D5.L8(A5)
A06: D2.L2(A6) D3.L2(A6) D4.L2(A6) D5.L2(A6)
A07: D2.M8(A7) D3.M8(A7) D4.M8(A7) D5.M8(A7)
A08: D2.M2(A8) D3.M2(A8) D4.M2(A8) D5.M2(A8)
A09: D2.M7(A9) D3.M7(A9) D4.M7(A9) D5.M7(A9)
A10: D2.J3(A10/AP) D3.J3(A10/AP) D4.J3(A10/AP) D5.J3(A10/AP)
A11: D2.N2(A11) D3.N2(A11) D4.N2(A11) D5.N2(A11)
A12: D2.J7(A12/BC_N) D3.J7(A12/BC_N) D4.J7(A12/BC_N) D5.J7(A12/BC_N)
A13: D2.N8(A13) D3.N8(A13) D4.N8(A13) D5.N8(A13)
A14: D2.H2(WE_N/A14) D3.H2(WE_N/A14) D4.H2(WE_N/A14) D5.H2(WE_N/A14)
A15: D2.H7(CAS_N/A15) D3.H7(CAS_N/A15) D4.H7(CAS_N/A15) D5.H7(CAS_N/A15)
A16: D2.H8(RAS_N/A16) D3.H8(RAS_N/A16) D4.H8(RAS_N/A16) D5.H8(RAS_N/A16)
ACT: D2.H3(ACT_N) D3.H3(ACT_N) D4.H3(ACT_N) D5.H3(ACT_N)
ALERT: D2.L9(ALERT_N) D3.L9(ALERT_N) D4.L9(ALERT_N) D5.L9(ALERT_N)
BA0: D2.K2(BA0) D3.K2(BA0) D4.K2(BA0) D5.K2(BA0)
BA1: D2.K8(BA1) D3.K8(BA1) D4.K8(BA1) D5.K8(BA1)
BG0: D2.J2(BG0) D3.J2(BG0) D4.J2(BG0) D5.J2(BG0)
BG1: D2.J8(BG1) D3.J8(BG1) D4.J8(BG1) D5.J8(BG1)
CK0_N: D2.F8(CK_C) D3.F8(CK_C) D4.F8(CK_C) D5.F8(CK_C)
CK0_P: D2.F7(CK_T) D3.F7(CK_T) D4.F7(CK_T) D5.F7(CK_T)
CKE0: D2.G3(CKE) D3.G3(CKE) D4.G3(CKE) D5.G3(CKE)
DM0R: D2.A7(NF,_NF/DM_N/DBI_N/TDQS_T)
DM1R: D3.A7(NF,_NF/DM_N/DBI_N/TDQS_T)
DM2R: D4.A7(NF,_NF/DM_N/DBI_N/TDQS_T)
DM3R: D5.A7(NF,_NF/DM_N/DBI_N/TDQS_T)
DQ00R: D2.B7(DQ1)
DQ01R: D2.D7(DQ3)
DQ02R: D2.D3(DQ2)
DQ03R: D2.C2(DQ0)
DQ04R: D2.D8(DQ5/NC)
DQ05R: D2.E7(DQ7/NC)
DQ06R: D2.D2(DQ4/NC)
DQ07R: D2.E3(DQ6/NC)
DQ08R: D3.E3(DQ6/NC)
DQ09R: D3.D2(DQ4/NC)
DQ10R: D3.D8(DQ5/NC)
DQ11R: D3.E7(DQ7/NC)
DQ12R: D3.C2(DQ0)
DQ13R: D3.D3(DQ2)
DQ14R: D3.D7(DQ3)
DQ15R: D3.B7(DQ1)
DQ16R: D4.D7(DQ3)
DQ17R: D4.B7(DQ1)
DQ18R: D4.D3(DQ2)
DQ19R: D4.C2(DQ0)
DQ20R: D4.E7(DQ7/NC)
DQ21R: D4.D8(DQ5/NC)
DQ22R: D4.D2(DQ4/NC)
DQ23R: D4.E3(DQ6/NC)
DQ24R: D5.D2(DQ4/NC)
DQ25R: D5.E3(DQ6/NC)
DQ26R: D5.D8(DQ5/NC)
DQ27R: D5.E7(DQ7/NC)
DQ28R: D5.D3(DQ2)
DQ29R: D5.C2(DQ0)
DQ30R: D5.B7(DQ1)
DQ31R: D5.D7(DQ3)
DQS0R_N: D2.B3(DQS_C)
DQS0R_P: D2.C3(DQS_T)
DQS1R_N: D3.B3(DQS_C)
DQS1R_P: D3.C3(DQS_T)
DQS2R_N: D4.B3(DQS_C)
DQS2R_P: D4.C3(DQS_T)
DQS3R_N: D5.B3(DQS_C)
DQS3R_P: D5.C3(DQS_T)
MEMRST: D2.L1(RESET_N) D3.L1(RESET_N) D4.L1(RESET_N) D5.L1(RESET_N)
ODT0: D2.F3(ODT) D3.F3(ODT) D4.F3(ODT) D5.F3(ODT)
PARITY: D2.N3(PAR) D3.N3(PAR) D4.N3(PAR) D5.N3(PAR)
S0: D2.G7(CS_N) D3.G7(CS_N) D4.G7(CS_N) D5.G7(CS_N)
VDD: D2.A1(VDD) D2.B2(VDDQ) D2.B8(VDDQ) D2.C1(VDDQ) D2.C7(VDD) D2.C9(VDDQ) D2.E2(VDDQ) D2.E8(VDDQ) D2.F1(VDD) D2.F9(VDD) D2.H1(VDD) D2.J9(VDD) D2.M1(VDD) D2.N9(VDD) D3.A1(VDD) D3.B2(VDDQ) D3.B8(VDDQ) D3.C1(VDDQ) D3.C7(VDD) D3.C9(VDDQ) D3.E2(VDDQ) D3.E8(VDDQ) D3.F1(VDD) D3.F9(VDD) D3.H1(VDD) D3.J9(VDD) D3.M1(VDD) D3.N9(VDD) D4.A1(VDD) D4.B2(VDDQ) D4.B8(VDDQ) D4.C1(VDDQ) D4.C7(VDD) D4.C9(VDDQ) D4.E2(VDDQ) D4.E8(VDDQ) D4.F1(VDD) D4.F9(VDD) D4.H1(VDD) D4.J9(VDD) D4.M1(VDD) D4.N9(VDD) D5.A1(VDD) D5.B2(VDDQ) D5.B8(VDDQ) D5.C1(VDDQ) D5.C7(VDD) D5.C9(VDDQ) D5.E2(VDDQ) D5.E8(VDDQ) D5.F1(VDD) D5.F9(VDD) D5.H1(VDD) D5.J9(VDD) D5.M1(VDD) D5.N9(VDD)
VPP: D2.B1(VPP) D2.M9(VPP) D3.B1(VPP) D3.M9(VPP) D4.B1(VPP) D4.M9(VPP) D5.B1(VPP) D5.M9(VPP)
VREFCA: D2.J1(VREFCA) D3.J1(VREFCA) D4.J1(VREFCA) D5.J1(VREFCA)
ZQ0: D2.B9(ZQ) R94.2
ZQ1: D3.B9(ZQ) R95.2
ZQ2: D4.B9(ZQ) R96.2
ZQ3: D5.B9(ZQ) R97.2

Not connected (* = marked no-connect by the designer): D2 A3(NF,_NF/TDQS_C) F2(C2/ODT1) G2(C0/CKE1) G8(C1/CS1_N) N7(A17/NC); D3 A3(NF,_NF/TDQS_C) F2(C2/ODT1) G2(C0/CKE1) G8(C1/CS1_N) N7(A17/NC); D4 A3(NF,_NF/TDQS_C) F2(C2/ODT1) G2(C0/CKE1) G8(C1/CS1_N) N7(A17/NC); D5 A3(NF,_NF/TDQS_C) F2(C2/ODT1) G2(C0/CKE1) G8(C1/CS1_N) N7(A17/NC)

### Layout directives
differential pair: DQS0R_N, DQS0R_P, DQS1R_N, DQS1R_P, DQS2R_N, DQS2R_P, DQS3R_N, DQS3R_P

### Notes on the sheet
- Title
- Size:
- Date:
- B
- Number:
- Time:
- Revision:
- Sheet
- of
- File:

### Library data of the parts
D2-D5 = CMP-1738-00001-1: 8 Gb DDR4 SDRAM, 1 Gig x 8, 1.2 V, 0 to 95 degC, 78-Ball FBGA (WE), RoHS; DatasheetVersion: Rev. E, 05/2016; ComponentLink2Description: Datasheet; ComponentLink2URL: https://www.micron.com/~/media/documents/products/data-sheet/dram/ddr4/8gb_ddr4_sdram.pdf; PartNumber: MT40A1G8WE-083E:B; PackageDescription: 78-Ball Ball Grid Array, Body 8 x 12 mm, Pitch 0.8 mm; ComponentLink1URL: http://www.micron.com/; ComponentLink1Description: Manufacturer URL; Mounting Technology: Surface Mount; PartId: 1
R94-R97 = CMP-2002-00493-3: Chip Resistor, 240 Ohm, +/- 5%, 100 mW, -55 to 155 degC, 0402 (1005 Metric), RoHS, Tape and Reel; Manufacturer: Basic Passives; Voltage Rating: 50 V; Case\/Package: 0402; Power Rating: 100 mW; PackageReference: 0402; ComponentLink1URL: http://www.panasonic.com/; ComponentLink2Description: Datasheet; PackageDescription: 2-Pin Surface Mount Device, Body 1 x 0.5 mm; Tolerance: 5%; Radiation Hardening: No; Packaging: Tape and Reel; Case Code (Metric): 1005; PartNumber: ERJ-2GEJ241x; Case Code (Imperial): 0402; Mount: Surface Mount; REACH SVHC: Yes; Length: 1 mm; Mounting Technology: Surface Mount; Max Operating Temperature: 155 degC; Height: 0.35 mm; Width: 0.5 mm; Package Quantity: 10000; RoHSCompliant: true; DatasheetVersion: 03/2015; Pins: 2; ComponentLink1Description: Manufacturer URL; Min Operating Temperature: -55 degC; ComponentLink2URL: http://industrial.panasonic.com/cdbs/www-data/pdf/RDA0000/AOA0000C84.pdf

## Sheet Sheet4.SchDoc: Memory ICs
size B; DocumentNumber: 4; SheetNumber: 4; SheetTotal: 5
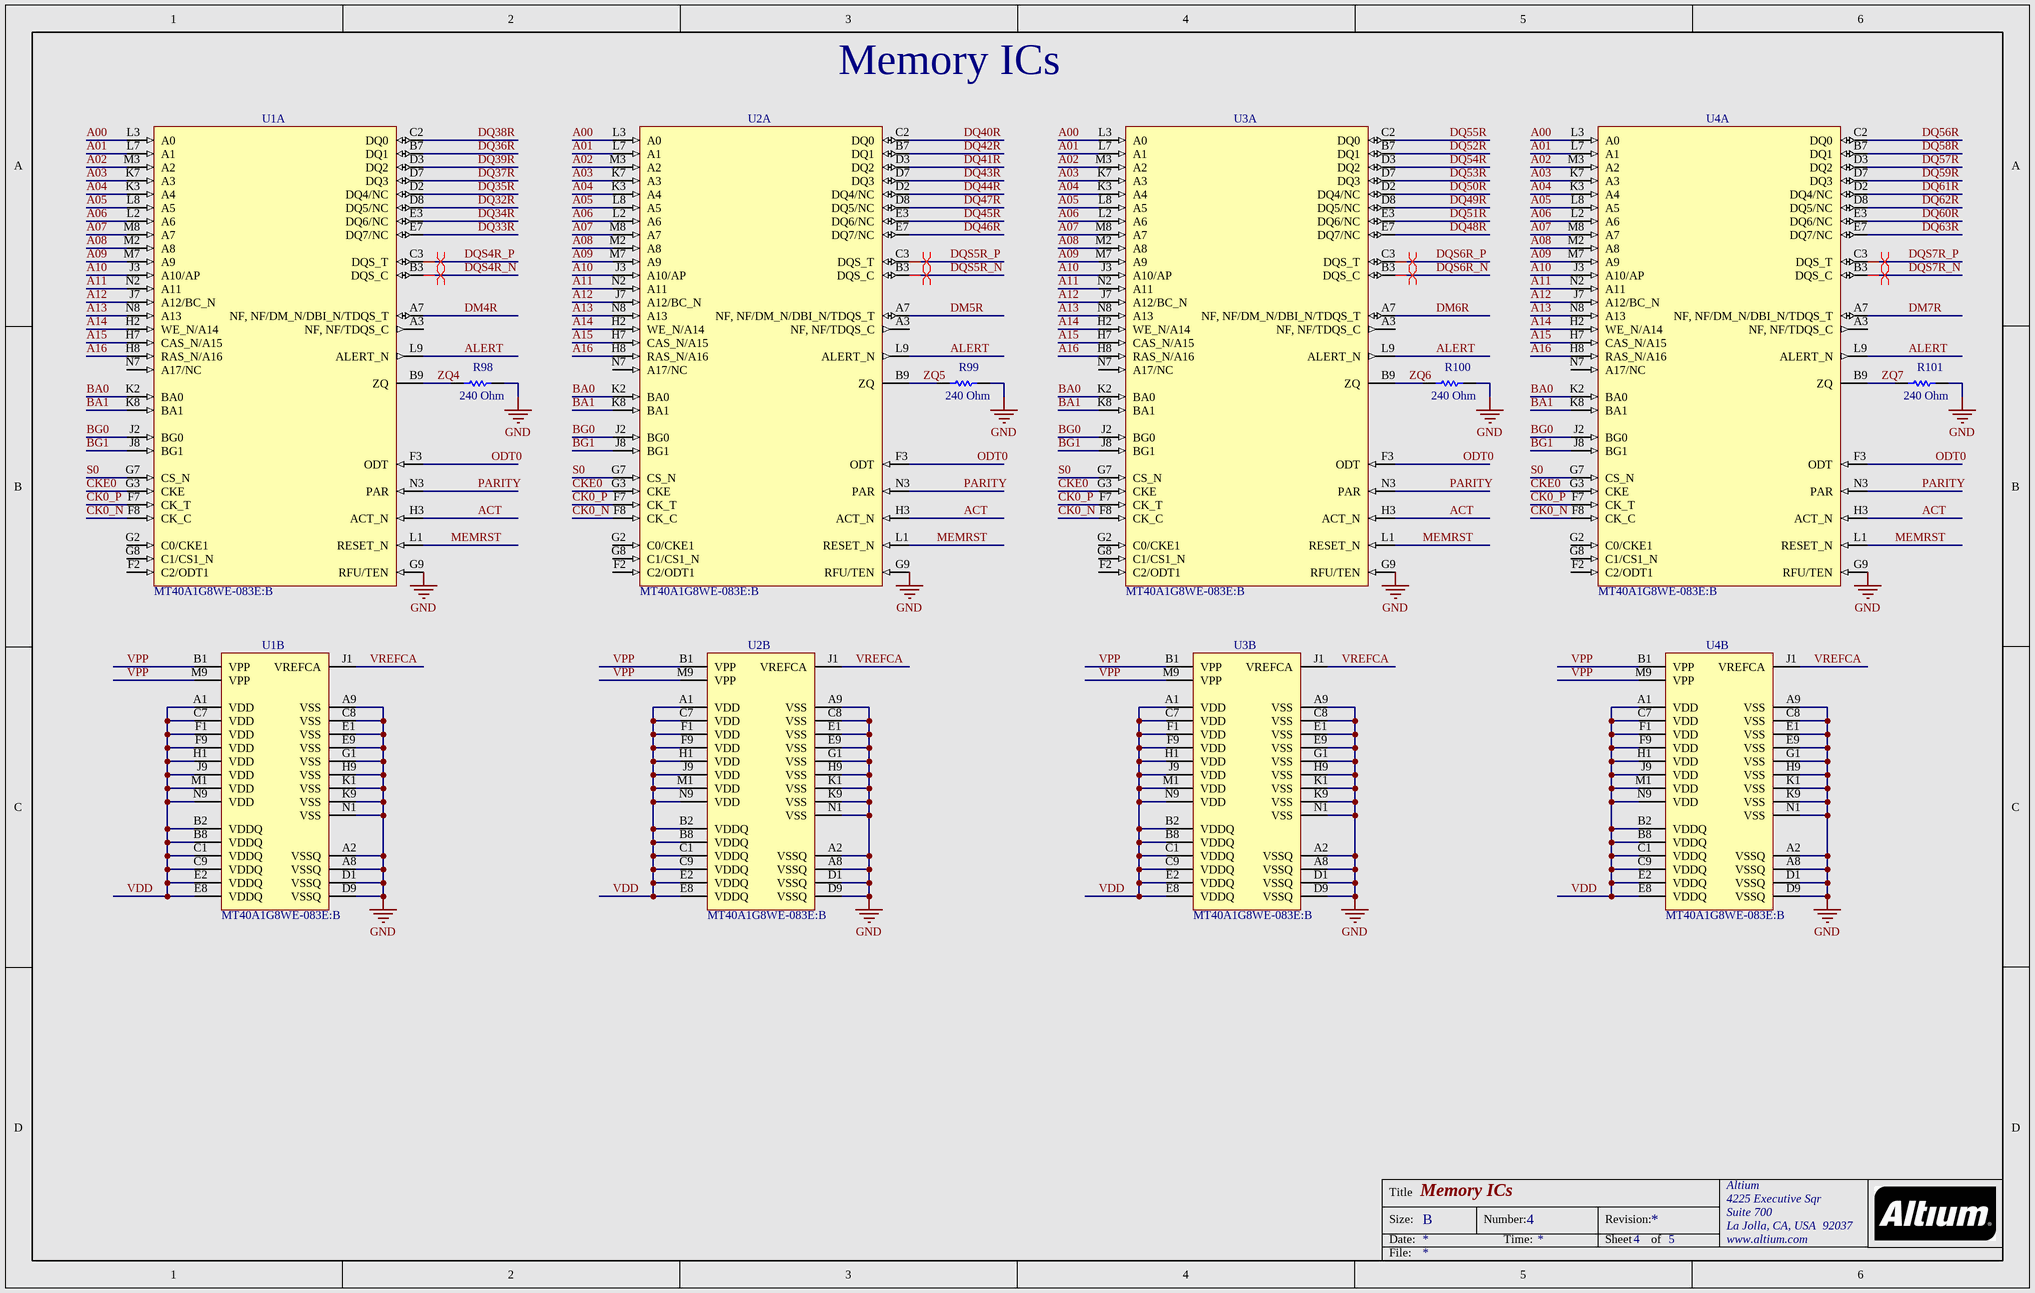
[diagram p3: Sheet4.SchDoc]

### Parts
R98  Resistance: 240 Ohm  [RESC1005X40X25ML05T05]  (hidden comment: ERJ-2GEJ241x)
R99  Resistance: 240 Ohm  [RESC1005X40X25ML05T05]  (hidden comment: ERJ-2GEJ241x)
R100  Resistance: 240 Ohm  [RESC1005X40X25ML05T05]  (hidden comment: ERJ-2GEJ241x)
R101  Resistance: 240 Ohm  [RESC1005X40X25ML05T05]  (hidden comment: ERJ-2GEJ241x)
U1  MT40A1G8WE-083E:B  [MICT-WE-78]  (parts A,B of 2)
U2  MT40A1G8WE-083E:B  [MICT-WE-78]  (parts A,B of 2)
U3  MT40A1G8WE-083E:B  [MICT-WE-78]  (parts A,B of 2)
U4  MT40A1G8WE-083E:B  [MICT-WE-78]  (parts A,B of 2)

### Nets
GND: R98.1 R99.1 R100.1 R101.1 U1.A2(VSSQ) U1.A8(VSSQ) U1.A9(VSS) U1.C8(VSS) U1.D1(VSSQ) U1.D9(VSSQ) U1.E1(VSS) U1.E9(VSS) U1.G1(VSS) U1.G9(RFU/TEN) U1.H9(VSS) U1.K1(VSS) U1.K9(VSS) U1.N1(VSS) U2.A2(VSSQ) U2.A8(VSSQ) U2.A9(VSS) U2.C8(VSS) U2.D1(VSSQ) U2.D9(VSSQ) U2.E1(VSS) U2.E9(VSS) U2.G1(VSS) U2.G9(RFU/TEN) U2.H9(VSS) U2.K1(VSS) U2.K9(VSS) U2.N1(VSS) U3.A2(VSSQ) U3.A8(VSSQ) U3.A9(VSS) U3.C8(VSS) U3.D1(VSSQ) U3.D9(VSSQ) U3.E1(VSS) U3.E9(VSS) U3.G1(VSS) U3.G9(RFU/TEN) U3.H9(VSS) U3.K1(VSS) U3.K9(VSS) U3.N1(VSS) U4.A2(VSSQ) U4.A8(VSSQ) U4.A9(VSS) U4.C8(VSS) U4.D1(VSSQ) U4.D9(VSSQ) U4.E1(VSS) U4.E9(VSS) U4.G1(VSS) U4.G9(RFU/TEN) U4.H9(VSS) U4.K1(VSS) U4.K9(VSS) U4.N1(VSS)
A00: U1.L3(A0) U2.L3(A0) U3.L3(A0) U4.L3(A0)
A01: U1.L7(A1) U2.L7(A1) U3.L7(A1) U4.L7(A1)
A02: U1.M3(A2) U2.M3(A2) U3.M3(A2) U4.M3(A2)
A03: U1.K7(A3) U2.K7(A3) U3.K7(A3) U4.K7(A3)
A04: U1.K3(A4) U2.K3(A4) U3.K3(A4) U4.K3(A4)
A05: U1.L8(A5) U2.L8(A5) U3.L8(A5) U4.L8(A5)
A06: U1.L2(A6) U2.L2(A6) U3.L2(A6) U4.L2(A6)
A07: U1.M8(A7) U2.M8(A7) U3.M8(A7) U4.M8(A7)
A08: U1.M2(A8) U2.M2(A8) U3.M2(A8) U4.M2(A8)
A09: U1.M7(A9) U2.M7(A9) U3.M7(A9) U4.M7(A9)
A10: U1.J3(A10/AP) U2.J3(A10/AP) U3.J3(A10/AP) U4.J3(A10/AP)
A11: U1.N2(A11) U2.N2(A11) U3.N2(A11) U4.N2(A11)
A12: U1.J7(A12/BC_N) U2.J7(A12/BC_N) U3.J7(A12/BC_N) U4.J7(A12/BC_N)
A13: U1.N8(A13) U2.N8(A13) U3.N8(A13) U4.N8(A13)
A14: U1.H2(WE_N/A14) U2.H2(WE_N/A14) U3.H2(WE_N/A14) U4.H2(WE_N/A14)
A15: U1.H7(CAS_N/A15) U2.H7(CAS_N/A15) U3.H7(CAS_N/A15) U4.H7(CAS_N/A15)
A16: U1.H8(RAS_N/A16) U2.H8(RAS_N/A16) U3.H8(RAS_N/A16) U4.H8(RAS_N/A16)
ACT: U1.H3(ACT_N) U2.H3(ACT_N) U3.H3(ACT_N) U4.H3(ACT_N)
ALERT: U1.L9(ALERT_N) U2.L9(ALERT_N) U3.L9(ALERT_N) U4.L9(ALERT_N)
BA0: U1.K2(BA0) U2.K2(BA0) U3.K2(BA0) U4.K2(BA0)
BA1: U1.K8(BA1) U2.K8(BA1) U3.K8(BA1) U4.K8(BA1)
BG0: U1.J2(BG0) U2.J2(BG0) U3.J2(BG0) U4.J2(BG0)
BG1: U1.J8(BG1) U2.J8(BG1) U3.J8(BG1) U4.J8(BG1)
CK0_N: U1.F8(CK_C) U2.F8(CK_C) U3.F8(CK_C) U4.F8(CK_C)
CK0_P: U1.F7(CK_T) U2.F7(CK_T) U3.F7(CK_T) U4.F7(CK_T)
CKE0: U1.G3(CKE) U2.G3(CKE) U3.G3(CKE) U4.G3(CKE)
DM4R: U1.A7(NF,_NF/DM_N/DBI_N/TDQS_T)
DM5R: U2.A7(NF,_NF/DM_N/DBI_N/TDQS_T)
DM6R: U3.A7(NF,_NF/DM_N/DBI_N/TDQS_T)
DM7R: U4.A7(NF,_NF/DM_N/DBI_N/TDQS_T)
DQ32R: U1.D8(DQ5/NC)
DQ33R: U1.E7(DQ7/NC)
DQ34R: U1.E3(DQ6/NC)
DQ35R: U1.D2(DQ4/NC)
DQ36R: U1.B7(DQ1)
DQ37R: U1.D7(DQ3)
DQ38R: U1.C2(DQ0)
DQ39R: U1.D3(DQ2)
DQ40R: U2.C2(DQ0)
DQ41R: U2.D3(DQ2)
DQ42R: U2.B7(DQ1)
DQ43R: U2.D7(DQ3)
DQ44R: U2.D2(DQ4/NC)
DQ45R: U2.E3(DQ6/NC)
DQ46R: U2.E7(DQ7/NC)
DQ47R: U2.D8(DQ5/NC)
DQ48R: U3.E7(DQ7/NC)
DQ49R: U3.D8(DQ5/NC)
DQ50R: U3.D2(DQ4/NC)
DQ51R: U3.E3(DQ6/NC)
DQ52R: U3.B7(DQ1)
DQ53R: U3.D7(DQ3)
DQ54R: U3.D3(DQ2)
DQ55R: U3.C2(DQ0)
DQ56R: U4.C2(DQ0)
DQ57R: U4.D3(DQ2)
DQ58R: U4.B7(DQ1)
DQ59R: U4.D7(DQ3)
DQ60R: U4.E3(DQ6/NC)
DQ61R: U4.D2(DQ4/NC)
DQ62R: U4.D8(DQ5/NC)
DQ63R: U4.E7(DQ7/NC)
DQS4R_N: U1.B3(DQS_C)
DQS4R_P: U1.C3(DQS_T)
DQS5R_N: U2.B3(DQS_C)
DQS5R_P: U2.C3(DQS_T)
DQS6R_N: U3.B3(DQS_C)
DQS6R_P: U3.C3(DQS_T)
DQS7R_N: U4.B3(DQS_C)
DQS7R_P: U4.C3(DQS_T)
MEMRST: U1.L1(RESET_N) U2.L1(RESET_N) U3.L1(RESET_N) U4.L1(RESET_N)
ODT0: U1.F3(ODT) U2.F3(ODT) U3.F3(ODT) U4.F3(ODT)
PARITY: U1.N3(PAR) U2.N3(PAR) U3.N3(PAR) U4.N3(PAR)
S0: U1.G7(CS_N) U2.G7(CS_N) U3.G7(CS_N) U4.G7(CS_N)
VDD: U1.A1(VDD) U1.B2(VDDQ) U1.B8(VDDQ) U1.C1(VDDQ) U1.C7(VDD) U1.C9(VDDQ) U1.E2(VDDQ) U1.E8(VDDQ) U1.F1(VDD) U1.F9(VDD) U1.H1(VDD) U1.J9(VDD) U1.M1(VDD) U1.N9(VDD) U2.A1(VDD) U2.B2(VDDQ) U2.B8(VDDQ) U2.C1(VDDQ) U2.C7(VDD) U2.C9(VDDQ) U2.E2(VDDQ) U2.E8(VDDQ) U2.F1(VDD) U2.F9(VDD) U2.H1(VDD) U2.J9(VDD) U2.M1(VDD) U2.N9(VDD) U3.A1(VDD) U3.B2(VDDQ) U3.B8(VDDQ) U3.C1(VDDQ) U3.C7(VDD) U3.C9(VDDQ) U3.E2(VDDQ) U3.E8(VDDQ) U3.F1(VDD) U3.F9(VDD) U3.H1(VDD) U3.J9(VDD) U3.M1(VDD) U3.N9(VDD) U4.A1(VDD) U4.B2(VDDQ) U4.B8(VDDQ) U4.C1(VDDQ) U4.C7(VDD) U4.C9(VDDQ) U4.E2(VDDQ) U4.E8(VDDQ) U4.F1(VDD) U4.F9(VDD) U4.H1(VDD) U4.J9(VDD) U4.M1(VDD) U4.N9(VDD)
VPP: U1.B1(VPP) U1.M9(VPP) U2.B1(VPP) U2.M9(VPP) U3.B1(VPP) U3.M9(VPP) U4.B1(VPP) U4.M9(VPP)
VREFCA: U1.J1(VREFCA) U2.J1(VREFCA) U3.J1(VREFCA) U4.J1(VREFCA)
ZQ4: R98.2 U1.B9(ZQ)
ZQ5: R99.2 U2.B9(ZQ)
ZQ6: R100.2 U3.B9(ZQ)
ZQ7: R101.2 U4.B9(ZQ)

Not connected (* = marked no-connect by the designer): U1 A3(NF,_NF/TDQS_C) F2(C2/ODT1) G2(C0/CKE1) G8(C1/CS1_N) N7(A17/NC); U2 A3(NF,_NF/TDQS_C) F2(C2/ODT1) G2(C0/CKE1) G8(C1/CS1_N) N7(A17/NC); U3 A3(NF,_NF/TDQS_C) F2(C2/ODT1) G2(C0/CKE1) G8(C1/CS1_N) N7(A17/NC); U4 A3(NF,_NF/TDQS_C) F2(C2/ODT1) G2(C0/CKE1) G8(C1/CS1_N) N7(A17/NC)

### Layout directives
differential pair: DQS4R_N, DQS4R_P, DQS5R_N, DQS5R_P, DQS6R_N, DQS6R_P, DQS7R_N, DQS7R_P

### Notes on the sheet
- Title
- Size:
- Date:
- B
- Number:
- Time:
- Revision:
- Sheet
- of
- File:

### Library data of the parts
R98-R101 = CMP-2002-00493-3: as R94 on sheet Sheet3; PackageReference: 0402; ComponentLink1URL: http://www.panasonic.com/; ComponentLink2Description: Datasheet; PackageDescription: 2-Pin Surface Mount Device, Body 1 x 0.5 mm; Tolerance: 5%; Radiation Hardening: No; Packaging: Tape and Reel; Case Code (Metric): 1005; PartNumber: ERJ-2GEJ241x; Case Code (Imperial): 0402; Mount: Surface Mount; REACH SVHC: Yes; Length: 1 mm; Mounting Technology: Surface Mount; Max Operating Temperature: 155 degC; Height: 0.35 mm; Width: 0.5 mm; Package Quantity: 10000; RoHSCompliant: true; DatasheetVersion: 03/2015; Pins: 2; ComponentLink1Description: Manufacturer URL; Min Operating Temperature: -55 degC; ComponentLink2URL: http://industrial.panasonic.com/cdbs/www-data/pdf/RDA0000/AOA0000C84.pdf
U1-U4 = CMP-1738-00001-1: as D2 on sheet Sheet3; DatasheetVersion: Rev. E, 05/2016; ComponentLink2Description: Datasheet; ComponentLink2URL: https://www.micron.com/~/media/documents/products/data-sheet/dram/ddr4/8gb_ddr4_sdram.pdf; PartNumber: MT40A1G8WE-083E:B; PackageDescription: 78-Ball Ball Grid Array, Body 8 x 12 mm, Pitch 0.8 mm; ComponentLink1URL: http://www.micron.com/; ComponentLink1Description: Manufacturer URL; Mounting Technology: Surface Mount; PartId: 1

## Sheet Sheet5.SchDoc: Power Decoupling
size B; DocumentNumber: 5; SheetNumber: 5; SheetTotal: 5
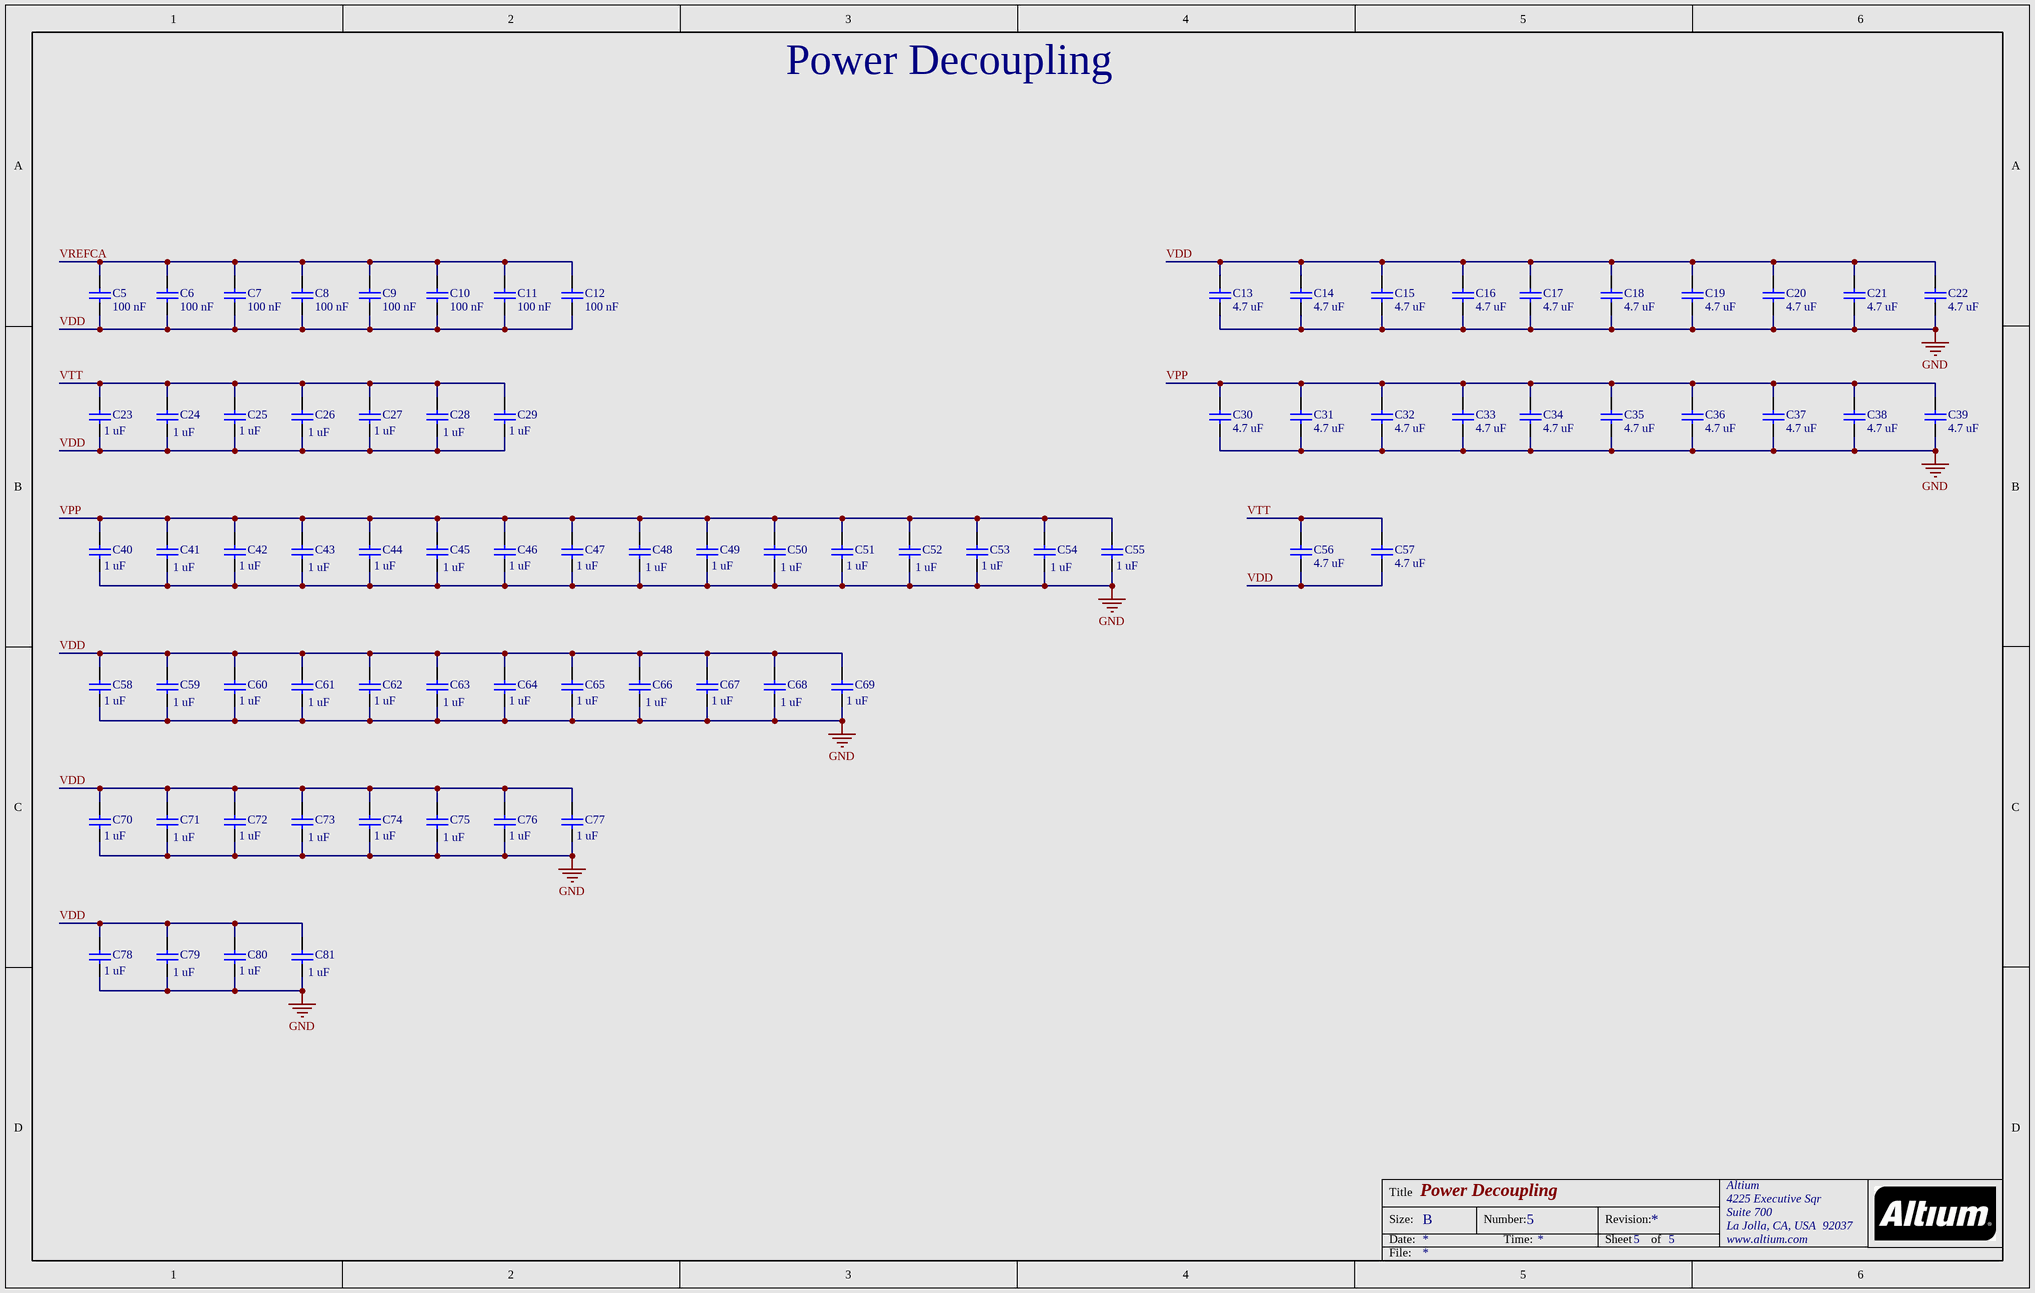
[diagram p4: Sheet5.SchDoc]

### Parts
C5  Capacitance: 100 nF  [CAPC1005X55X10LL05]  (hidden comment: C1005X7R1E104M)
C6  Capacitance: 100 nF  [CAPC1005X55X10LL05]  (hidden comment: C1005X7R1E104M)
C7  Capacitance: 100 nF  [CAPC1005X55X10LL05]  (hidden comment: C1005X7R1E104M)
C8  Capacitance: 100 nF  [CAPC1005X55X10LL05]  (hidden comment: C1005X7R1E104M)
C9  Capacitance: 100 nF  [CAPC1005X55X10LL05]  (hidden comment: C1005X7R1E104M)
C10  Capacitance: 100 nF  [CAPC1005X55X10LL05]  (hidden comment: C1005X7R1E104M)
C11  Capacitance: 100 nF  [CAPC1005X55X10LL05]  (hidden comment: C1005X7R1E104M)
C12  Capacitance: 100 nF  [CAPC1005X55X10LL05]  (hidden comment: C1005X7R1E104M)
C13  Capacitance: 4.7 uF  [CAPC1608X90X35ML10T15]  (hidden comment: GRM188R60J475KE19D)
C14  Capacitance: 4.7 uF  [CAPC1608X90X35ML10T15]  (hidden comment: GRM188R60J475KE19D)
C15  Capacitance: 4.7 uF  [CAPC1608X90X35ML10T15]  (hidden comment: GRM188R60J475KE19D)
C16  Capacitance: 4.7 uF  [CAPC1608X90X35ML10T15]  (hidden comment: GRM188R60J475KE19D)
C17  Capacitance: 4.7 uF  [CAPC1608X90X35ML10T15]  (hidden comment: GRM188R60J475KE19D)
C18  Capacitance: 4.7 uF  [CAPC1608X90X35ML10T15]  (hidden comment: GRM188R60J475KE19D)
C19  Capacitance: 4.7 uF  [CAPC1608X90X35ML10T15]  (hidden comment: GRM188R60J475KE19D)
C20  Capacitance: 4.7 uF  [CAPC1608X90X35ML10T15]  (hidden comment: GRM188R60J475KE19D)
C21  Capacitance: 4.7 uF  [CAPC1608X90X35ML10T15]  (hidden comment: GRM188R60J475KE19D)
C22  Capacitance: 4.7 uF  [CAPC1608X90X35ML10T15]  (hidden comment: GRM188R60J475KE19D)
C23  Capacitance: 1 uF  [CAPC1005X33X10LL5]  (hidden comment: CGB2A1X5R1E105K033BC)
C24  Capacitance: 1 uF  [CAPC1005X33X10LL5]  (hidden comment: CGB2A1X5R1E105K033BC)
C25  Capacitance: 1 uF  [CAPC1005X33X10LL5]  (hidden comment: CGB2A1X5R1E105K033BC)
C26  Capacitance: 1 uF  [CAPC1005X33X10LL5]  (hidden comment: CGB2A1X5R1E105K033BC)
C27  Capacitance: 1 uF  [CAPC1005X33X10LL5]  (hidden comment: CGB2A1X5R1E105K033BC)
C28  Capacitance: 1 uF  [CAPC1005X33X10LL5]  (hidden comment: CGB2A1X5R1E105K033BC)
C29  Capacitance: 1 uF  [CAPC1005X33X10LL5]  (hidden comment: CGB2A1X5R1E105K033BC)
C30  Capacitance: 4.7 uF  [CAPC1608X90X35ML10T15]  (hidden comment: GRM188R60J475KE19D)
C31  Capacitance: 4.7 uF  [CAPC1608X90X35ML10T15]  (hidden comment: GRM188R60J475KE19D)
C32  Capacitance: 4.7 uF  [CAPC1608X90X35ML10T15]  (hidden comment: GRM188R60J475KE19D)
C33  Capacitance: 4.7 uF  [CAPC1608X90X35ML10T15]  (hidden comment: GRM188R60J475KE19D)
C34  Capacitance: 4.7 uF  [CAPC1608X90X35ML10T15]  (hidden comment: GRM188R60J475KE19D)
C35  Capacitance: 4.7 uF  [CAPC1608X90X35ML10T15]  (hidden comment: GRM188R60J475KE19D)
C36  Capacitance: 4.7 uF  [CAPC1608X90X35ML10T15]  (hidden comment: GRM188R60J475KE19D)
C37  Capacitance: 4.7 uF  [CAPC1608X90X35ML10T15]  (hidden comment: GRM188R60J475KE19D)
C38  Capacitance: 4.7 uF  [CAPC1608X90X35ML10T15]  (hidden comment: GRM188R60J475KE19D)
C39  Capacitance: 4.7 uF  [CAPC1608X90X35ML10T15]  (hidden comment: GRM188R60J475KE19D)
C40  Capacitance: 1 uF  [CAPC1005X33X10LL5]  (hidden comment: CGB2A1X5R1E105K033BC)
C41  Capacitance: 1 uF  [CAPC1005X33X10LL5]  (hidden comment: CGB2A1X5R1E105K033BC)
C42  Capacitance: 1 uF  [CAPC1005X33X10LL5]  (hidden comment: CGB2A1X5R1E105K033BC)
C43  Capacitance: 1 uF  [CAPC1005X33X10LL5]  (hidden comment: CGB2A1X5R1E105K033BC)
C44  Capacitance: 1 uF  [CAPC1005X33X10LL5]  (hidden comment: CGB2A1X5R1E105K033BC)
C45  Capacitance: 1 uF  [CAPC1005X33X10LL5]  (hidden comment: CGB2A1X5R1E105K033BC)
C46  Capacitance: 1 uF  [CAPC1005X33X10LL5]  (hidden comment: CGB2A1X5R1E105K033BC)
C47  Capacitance: 1 uF  [CAPC1005X33X10LL5]  (hidden comment: CGB2A1X5R1E105K033BC)
C48  Capacitance: 1 uF  [CAPC1005X33X10LL5]  (hidden comment: CGB2A1X5R1E105K033BC)
C49  Capacitance: 1 uF  [CAPC1005X33X10LL5]  (hidden comment: CGB2A1X5R1E105K033BC)
C50  Capacitance: 1 uF  [CAPC1005X33X10LL5]  (hidden comment: CGB2A1X5R1E105K033BC)
C51  Capacitance: 1 uF  [CAPC1005X33X10LL5]  (hidden comment: CGB2A1X5R1E105K033BC)
C52  Capacitance: 1 uF  [CAPC1005X33X10LL5]  (hidden comment: CGB2A1X5R1E105K033BC)
C53  Capacitance: 1 uF  [CAPC1005X33X10LL5]  (hidden comment: CGB2A1X5R1E105K033BC)
C54  Capacitance: 1 uF  [CAPC1005X33X10LL5]  (hidden comment: CGB2A1X5R1E105K033BC)
C55  Capacitance: 1 uF  [CAPC1005X33X10LL5]  (hidden comment: CGB2A1X5R1E105K033BC)
C56  Capacitance: 4.7 uF  [CAPC1608X90X35ML10T15]  (hidden comment: GRM188R60J475KE19D)
C57  Capacitance: 4.7 uF  [CAPC1608X90X35ML10T15]  (hidden comment: GRM188R60J475KE19D)
C58  Capacitance: 1 uF  [CAPC1005X33X10LL5]  (hidden comment: CGB2A1X5R1E105K033BC)
C59  Capacitance: 1 uF  [CAPC1005X33X10LL5]  (hidden comment: CGB2A1X5R1E105K033BC)
C60  Capacitance: 1 uF  [CAPC1005X33X10LL5]  (hidden comment: CGB2A1X5R1E105K033BC)
C61  Capacitance: 1 uF  [CAPC1005X33X10LL5]  (hidden comment: CGB2A1X5R1E105K033BC)
C62  Capacitance: 1 uF  [CAPC1005X33X10LL5]  (hidden comment: CGB2A1X5R1E105K033BC)
C63  Capacitance: 1 uF  [CAPC1005X33X10LL5]  (hidden comment: CGB2A1X5R1E105K033BC)
C64  Capacitance: 1 uF  [CAPC1005X33X10LL5]  (hidden comment: CGB2A1X5R1E105K033BC)
C65  Capacitance: 1 uF  [CAPC1005X33X10LL5]  (hidden comment: CGB2A1X5R1E105K033BC)
C66  Capacitance: 1 uF  [CAPC1005X33X10LL5]  (hidden comment: CGB2A1X5R1E105K033BC)
C67  Capacitance: 1 uF  [CAPC1005X33X10LL5]  (hidden comment: CGB2A1X5R1E105K033BC)
C68  Capacitance: 1 uF  [CAPC1005X33X10LL5]  (hidden comment: CGB2A1X5R1E105K033BC)
C69  Capacitance: 1 uF  [CAPC1005X33X10LL5]  (hidden comment: CGB2A1X5R1E105K033BC)
C70  Capacitance: 1 uF  [CAPC1005X33X10LL5]  (hidden comment: CGB2A1X5R1E105K033BC)
C71  Capacitance: 1 uF  [CAPC1005X33X10LL5]  (hidden comment: CGB2A1X5R1E105K033BC)
C72  Capacitance: 1 uF  [CAPC1005X33X10LL5]  (hidden comment: CGB2A1X5R1E105K033BC)
C73  Capacitance: 1 uF  [CAPC1005X33X10LL5]  (hidden comment: CGB2A1X5R1E105K033BC)
C74  Capacitance: 1 uF  [CAPC1005X33X10LL5]  (hidden comment: CGB2A1X5R1E105K033BC)
C75  Capacitance: 1 uF  [CAPC1005X33X10LL5]  (hidden comment: CGB2A1X5R1E105K033BC)
C76  Capacitance: 1 uF  [CAPC1005X33X10LL5]  (hidden comment: CGB2A1X5R1E105K033BC)
C77  Capacitance: 1 uF  [CAPC1005X33X10LL5]  (hidden comment: CGB2A1X5R1E105K033BC)
C78  Capacitance: 1 uF  [CAPC1005X33X10LL5]  (hidden comment: CGB2A1X5R1E105K033BC)
C79  Capacitance: 1 uF  [CAPC1005X33X10LL5]  (hidden comment: CGB2A1X5R1E105K033BC)
C80  Capacitance: 1 uF  [CAPC1005X33X10LL5]  (hidden comment: CGB2A1X5R1E105K033BC)
C81  Capacitance: 1 uF  [CAPC1005X33X10LL5]  (hidden comment: CGB2A1X5R1E105K033BC)

### Nets
GND: C13.1 C14.1 C15.1 C16.1 C17.1 C18.1 C19.1 C20.1 C21.1 C22.1 C30.1 C31.1 C32.1 C33.1 C34.1 C35.1 C36.1 C37.1 C38.1 C39.1 C40.1 C41.1 C42.1 C43.1 C44.1 C45.1 C46.1 C47.1 C48.1 C49.1 C50.1 C51.1 C52.1 C53.1 C54.1 C55.1 C58.1 C59.1 C60.1 C61.1 C62.1 C63.1 C64.1 C65.1 C66.1 C67.1 C68.1 C69.1 C70.1 C71.1 C72.1 C73.1 C74.1 C75.1 C76.1 C77.1 C78.1 C79.1 C80.1 C81.1
VDD: C5.1 C6.1 C7.1 C8.1 C9.1 C10.1 C11.1 C12.1 C13.2 C14.2 C15.2 C16.2 C17.2 C18.2 C19.2 C20.2 C21.2 C22.2 C23.1 C24.1 C25.1 C26.1 C27.1 C28.1 C29.1 C56.1 C57.1 C58.2 C59.2 C60.2 C61.2 C62.2 C63.2 C64.2 C65.2 C66.2 C67.2 C68.2 C69.2 C70.2 C71.2 C72.2 C73.2 C74.2 C75.2 C76.2 C77.2 C78.2 C79.2 C80.2 C81.2
VPP: C30.2 C31.2 C32.2 C33.2 C34.2 C35.2 C36.2 C37.2 C38.2 C39.2 C40.2 C41.2 C42.2 C43.2 C44.2 C45.2 C46.2 C47.2 C48.2 C49.2 C50.2 C51.2 C52.2 C53.2 C54.2 C55.2
VREFCA: C5.2 C6.2 C7.2 C8.2 C9.2 C10.2 C11.2 C12.2
VTT: C23.2 C24.2 C25.2 C26.2 C27.2 C28.2 C29.2 C56.2 C57.2

### Notes on the sheet
- Title
- Size:
- Date:
- B
- Number:
- Time:
- Revision:
- Sheet
- of
- File:

### Library data of the parts
C5-C12 = CMP-1663-00009-2: as C2 on sheet Sheet1; PackageReference: 0402; Tolerance: 20%; Height: 0.5 mm; Package Quantity: 10000; Mounting Technology: Surface Mount; Width: 0.5 mm; Packaging: Tape and Reel; Case Code (Metric): 1005; Pins: 2; Voltage Rating (DC): 25 V; ComponentLink2URL: http://www.farnell.com/datasheets/1571323.pdf; ComponentLink1URL: http://www.tdk.com/; PackageDescription: 2-Pin Surface Mount Device, Body 1 x 0.5 mm; Max Operating Temperature: 125 degC; ComponentLink2Description: Datasheet; PartNumber: C1005X7R1E104M; Mount: Surface Mount; RoHSCompliant: true; ComponentLink1Description: Manufacturer URL; Min Operating Temperature: -55 degC; Length: 1 mm; Case Code (Imperial): 0402; DatasheetVersion: 09/2011
C13-C22 C30-C39 C56 C57 = CMP-2006-02799-2: Chip Capacitor, 4.7 uF, +/- 10%, 6.3 V, -55 to 85 degC, 0603 (1608 Metric), RoHS, Tape and Reel; Voltage Rating (DC): 3 V; Voltage Rating: 6.3 V; Type (Capacitors): X5R; Case/Package: 0603; Case Code (Imperial): 0603; Packaging: Tape and Reel; Mount: Surface Mount; Height: 0.8 mm; REACH SVHC: No SVHC; ComponentLink1URL: http://www.murata.com/; ComponentLink2URL: http://psearch.en.murata.com/capacitor/product/GRM188R60J475KE19%23.pdf; Min Operating Temperature: -55 degC; Max Operating Temperature: 85 degC; Length: 1.6 mm; Case Code (Metric): 1608; Radiation Hardening: No; PackageDescription: 2-Pin Surface Mount Device, Body 1.6 x 0.8 mm; RoHSCompliant: true; PartNumber: GRM188R60J475KE19D; Tolerance: 10%; Width: 0.8 mm; ComponentLink1Description: Manufacturer URL; Mounting Technology: Surface Mount; ComponentLink2Description: Datasheet; Package Quantity: 4000; DatasheetVersion: 08/2016
C23-C29 C40-C55 C58-C81 = CMP-1663-00006-2: Chip Capacitor, 1 uF, +/- 10%, 25 V, -55 to 85 degC, 0402 (1005 Metric), RoHS, Tape and Reel; PackageDescription: 2-Pin Surface Mount Device, Body 1 x 0.5 mm; PartNumber: CGB2A1X5R1E105K033BC; Case Code (Metric): 1005; DatasheetVersion: 04/2015; RoHSCompliant: True; Max Operating Temperature: 85 degC; ComponentLink2URL: https://product.tdk.com/info/en/catalog/datasheets/mlcc_commercial_lowprofile_en.pdf; Package Quantity: 1; Width: 0.02 inch; Case/Package: 0402; Case Code (Imperial): 0402; Packaging: Tape and Reel; Tolerance: 10%; Length: 0.039 inch; Min Operating Temperature: -55 degC; Mounting Technology: Surface Mount; ComponentLink2Description: Datasheet; ComponentLink1URL: http://www.tdk.com/; ComponentLink1Description: Manufacturer URL